# EAGLE design UP-Module-fused-IOs (EAGLE 9.4.0)
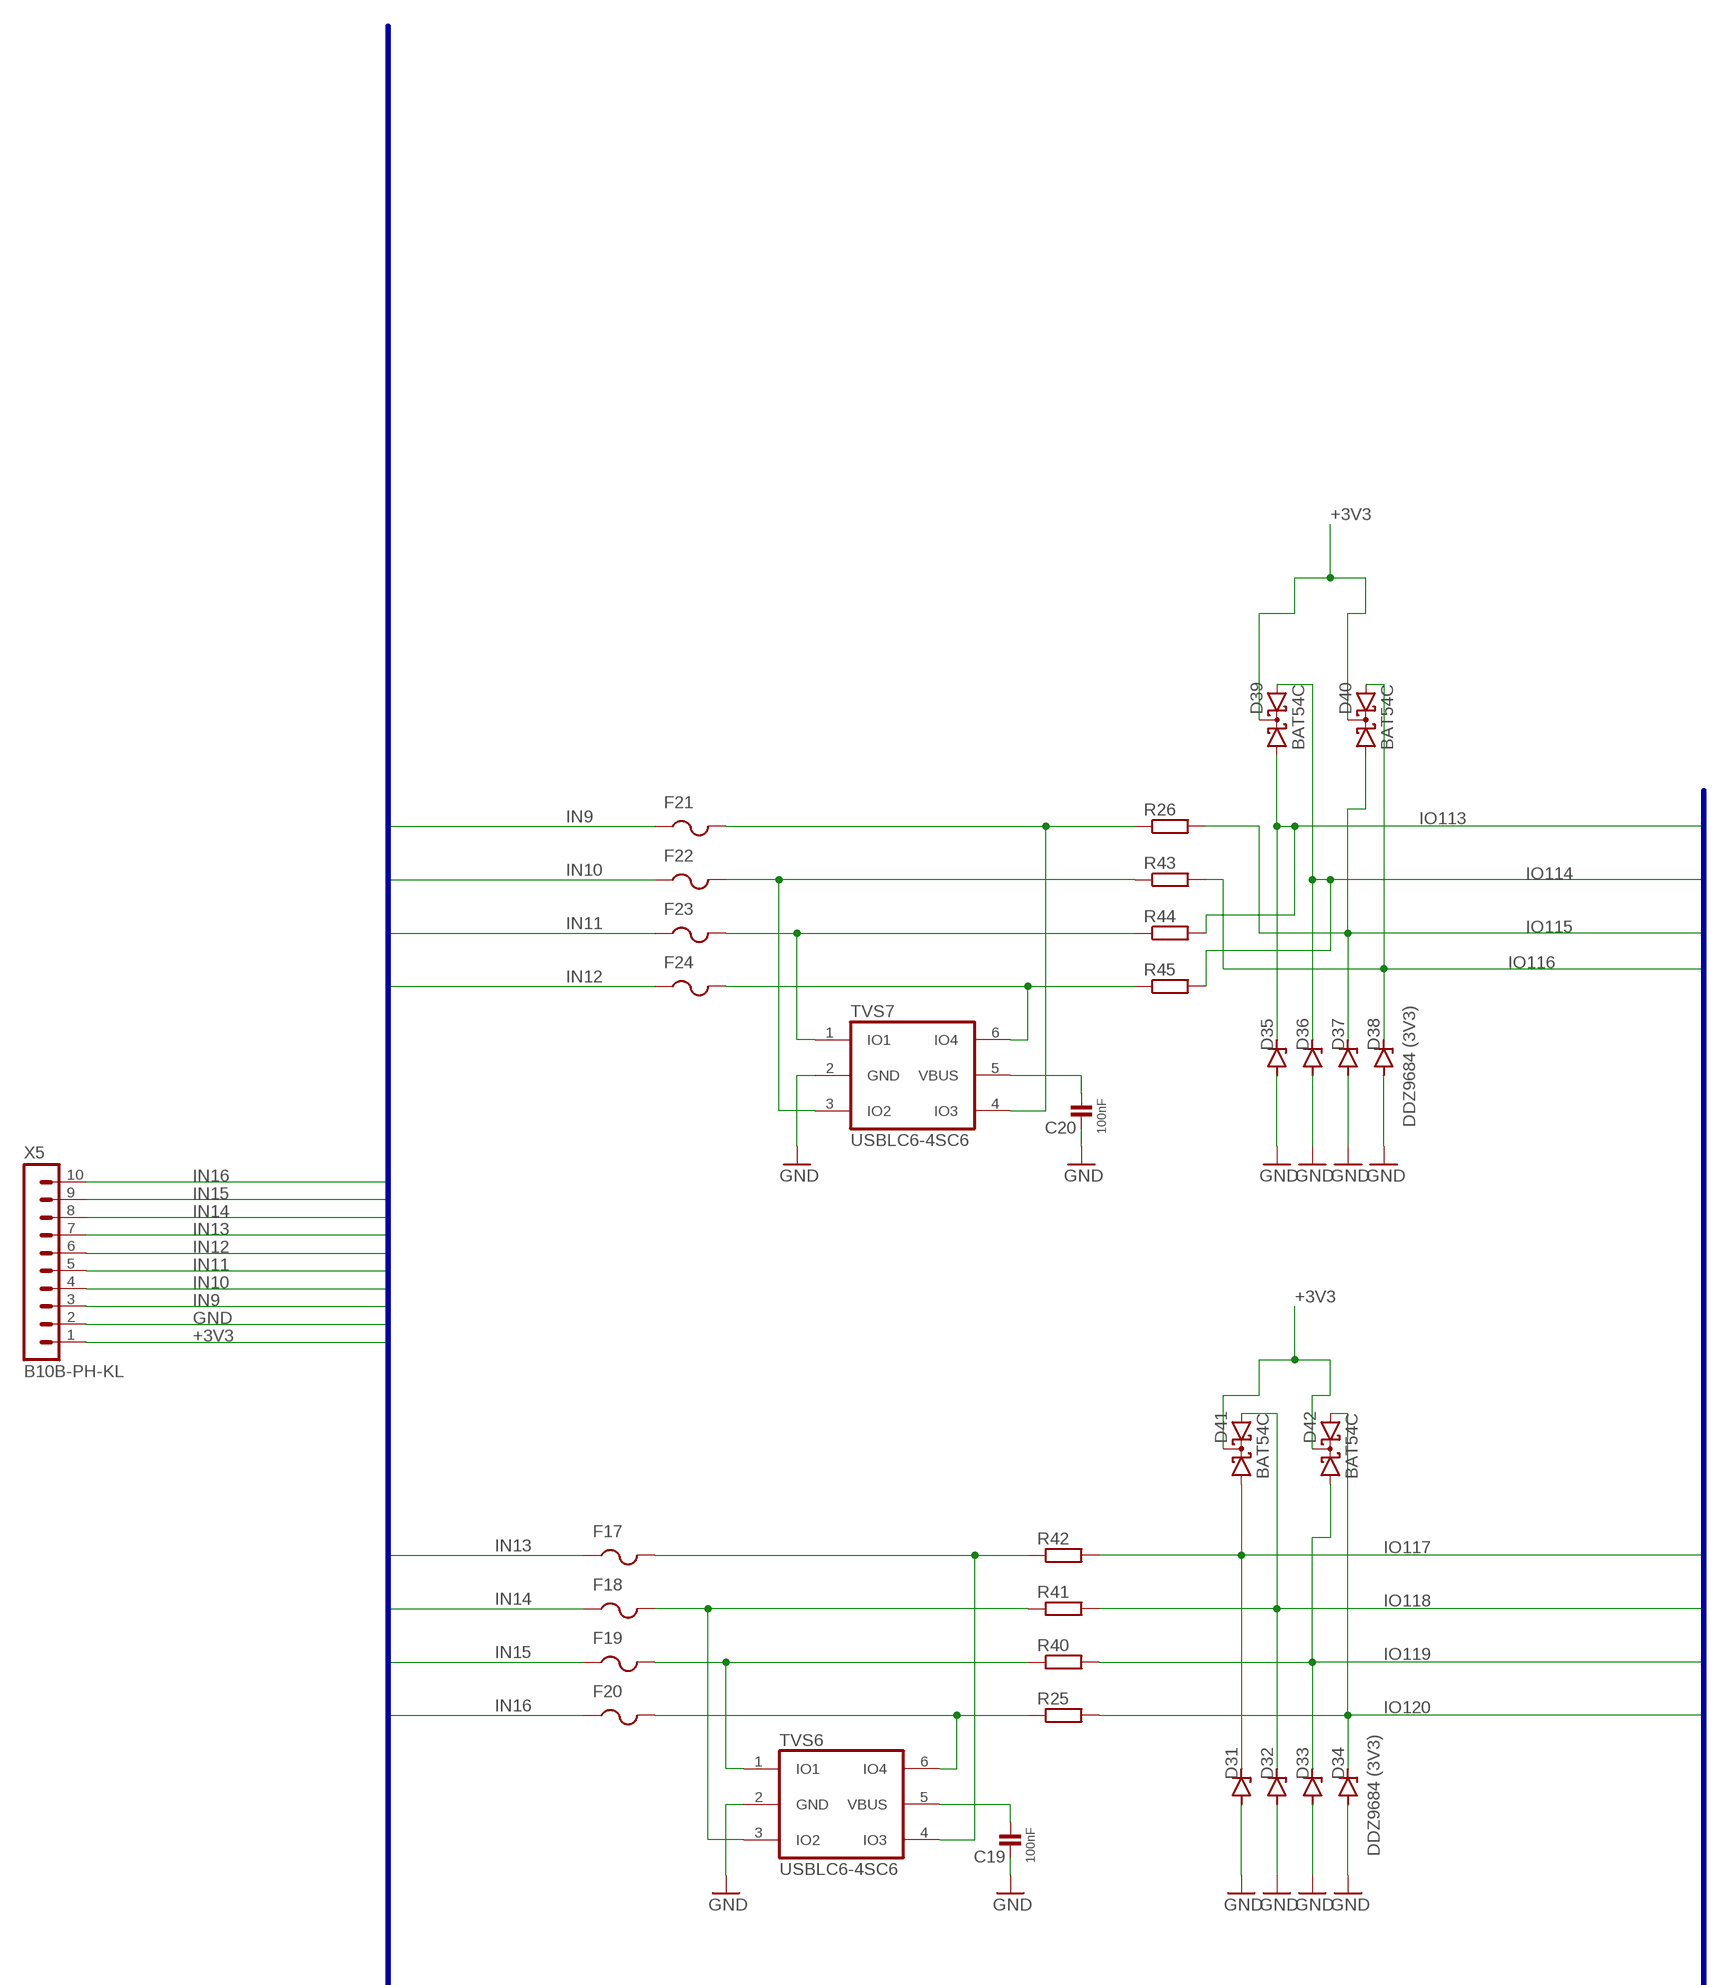
[diagram p0: schematic, sheet 1, part 1 of 3]
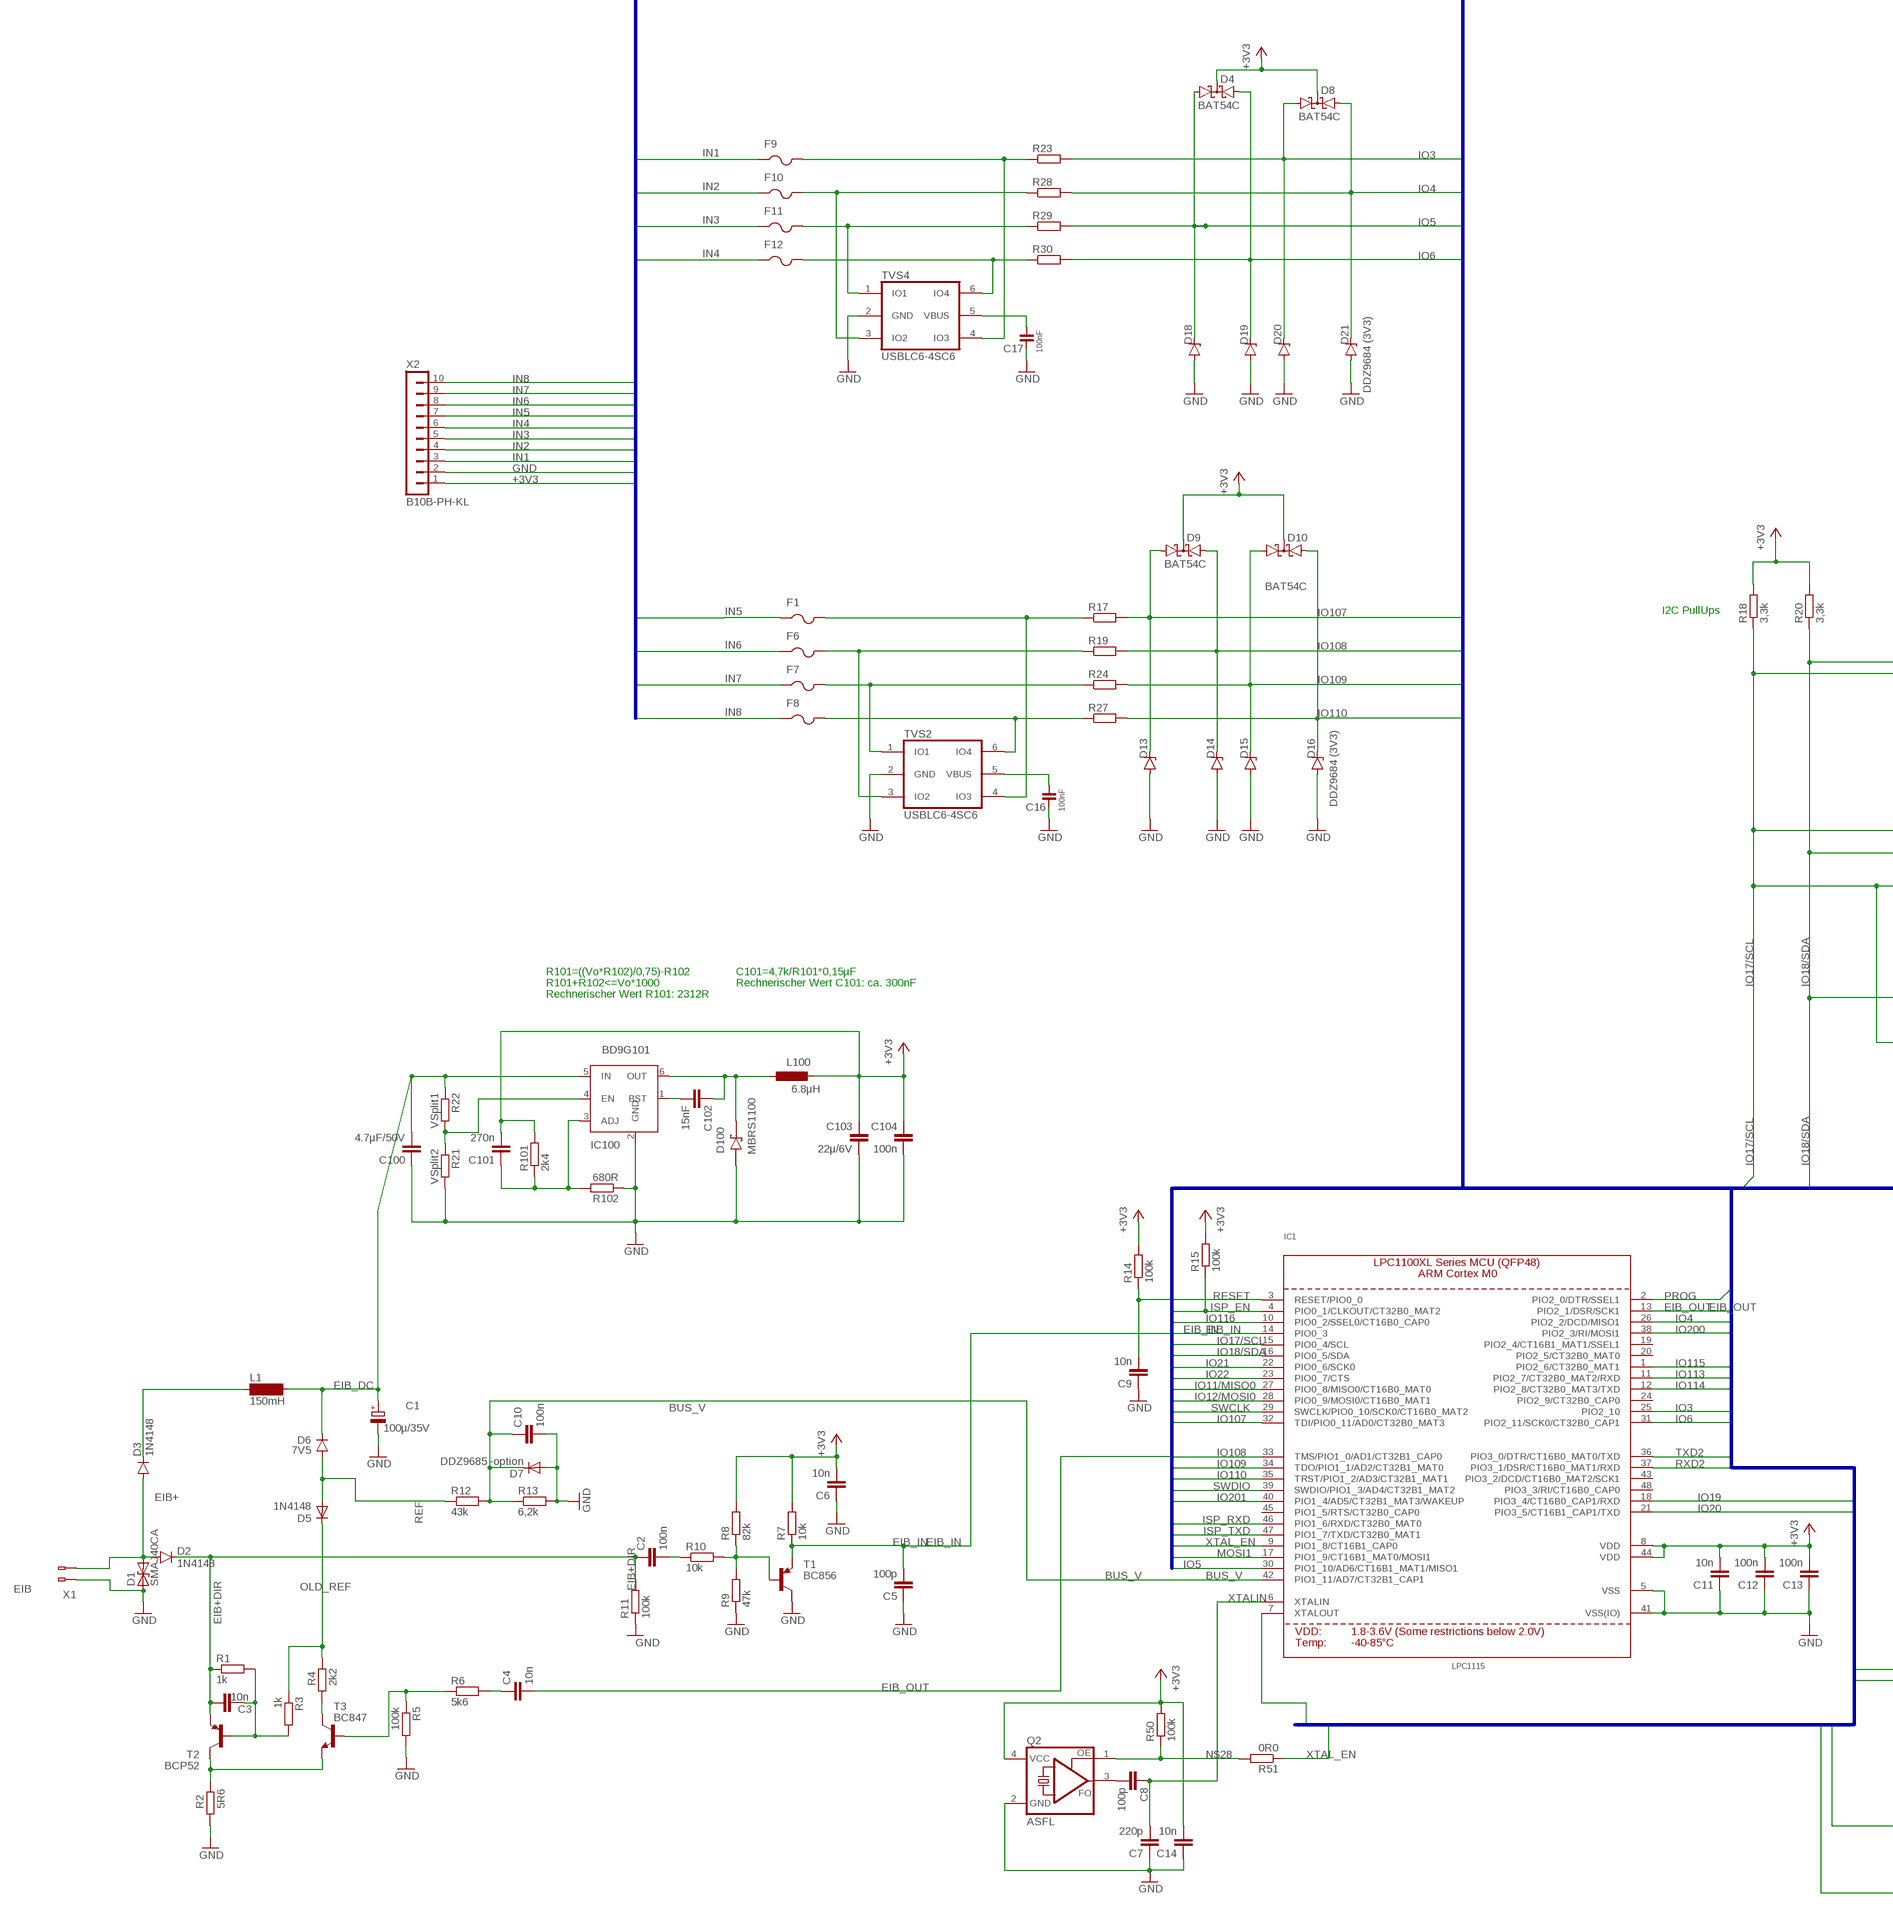
[diagram p1: schematic, sheet 1, part 2 of 3]
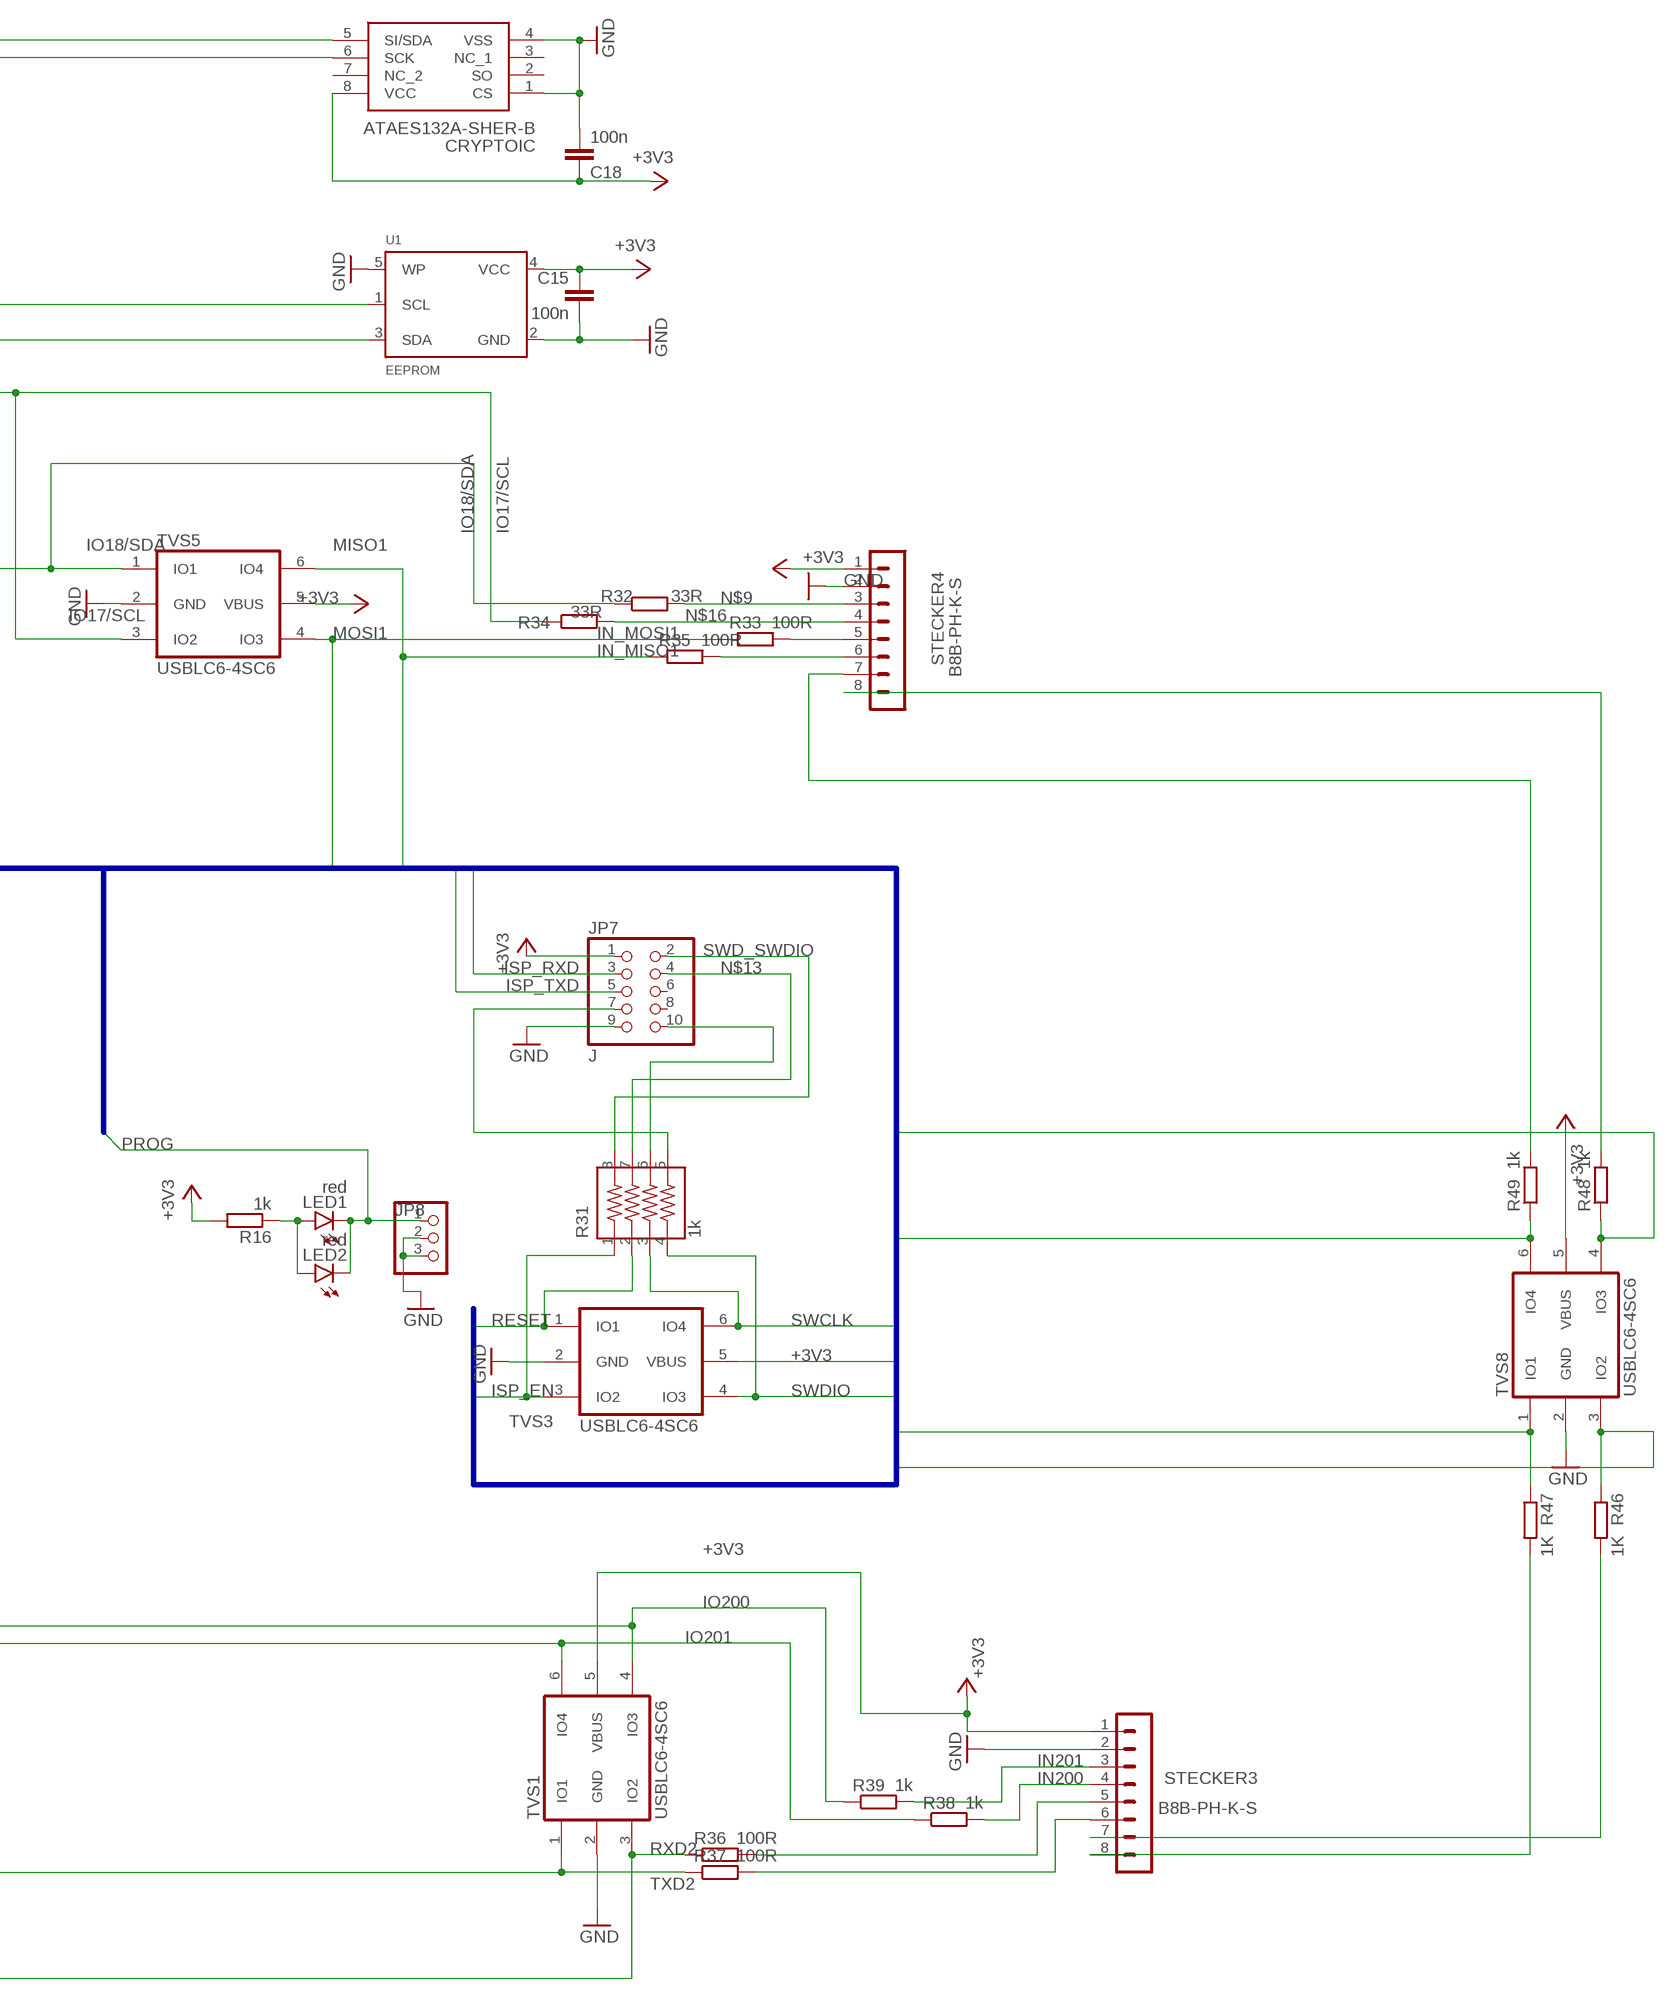
[diagram p2: schematic, sheet 1, part 3 of 3]

## Parts
C1  100µ/35V  CPOL-EUSANYO_SMD_C6  [SANYO-OSCON_SMD_C6]
C2  100n  C-EUC0805  [C0805]
C3  10n  C-EUC0805  [C0805]
C4  10n  C-EUC0805  [C0805]
C5  100p  C-EUC0805  [C0805]
C6  10n  C-EUC0805  [C0805]
C7  220p  C-EUC0805  [C0805]
C8  100p  C-EUC0805  [C0805]
C9  10n  C-EUC0805  [C0805]
C10  100n  C-EUC0805  [C0805]
C11  10n  C-EUC0805  [C0805]
C12  100n  C-EUC0805  [C0805]
C13  100n  C-EUC0805  [C0805]
C14  10n  C-EUC0805  [C0805]
C15  100n  C-EUC0805  [C0805]
C16  100nF  C-EUC0805  [C0805]
C17  100nF  C-EUC0805  [C0805]
C18  100n  C-EUC0805  [C0805]
C19  100nF  C-EUC0805  [C0805]
C20  100nF  C-EUC0805  [C0805]
C100  4.7µF/50V  C-EUC0805  [C0805]
C101  270n  C-EUC0805  [C0805]
C102  15nF  C-EUC0805  [C0805]
C103  22µ/6V  C-EUC0805  [C0805]
C104  100n  C-EUC0805  [C0805]
CRYPTOIC  ATAES132A-SHER-B  [SOIC127P600X175-8N]
D1  SMAJ40CA  [DO214AC]
D2  1N4148  DIODE-SOD323-R  [SOD323-R]
D3  1N4148  DIODE-SOD323-R  [SOD323-R]
D4  BAT54C  [SOT23]
D5  1N4148  DIODE-SOD323-R  [SOD323-R]
D6  7V5  DIODE-SOD323-R  [SOD323-R]
D7  DDZ9685 -option  DIODESOD-123  [SOD-123]
D8  BAT54C  [SOT23]
D9  BAT54C  [SOT23]
D10  BAT54C  [SOT23]
D13  DDZ9684 (3V3)  ZENER_MMSZ5240BTDO-219-AB(SOD123F)  [SODFL3718X115]
D14  DDZ9684 (3V3)  ZENER_MMSZ5240BTDO-219-AB(SOD123F)  [SODFL3718X115]
D15  DDZ9684 (3V3)  ZENER_MMSZ5240BTDO-219-AB(SOD123F)  [SODFL3718X115]
D16  DDZ9684 (3V3)  ZENER_MMSZ5240BTDO-219-AB(SOD123F)  [SODFL3718X115]
D18  DDZ9684 (3V3)  ZENER_MMSZ5240BTDO-219-AB(SOD123F)  [SODFL3718X115]
D19  DDZ9684 (3V3)  ZENER_MMSZ5240BTDO-219-AB(SOD123F)  [SODFL3718X115]
D20  DDZ9684 (3V3)  ZENER_MMSZ5240BTDO-219-AB(SOD123F)  [SODFL3718X115]
D21  DDZ9684 (3V3)  ZENER_MMSZ5240BTDO-219-AB(SOD123F)  [SODFL3718X115]
D31  DDZ9684 (3V3)  ZENER_MMSZ5240BTDO-219-AB(SOD123F)  [SODFL3718X115]
D32  DDZ9684 (3V3)  ZENER_MMSZ5240BTDO-219-AB(SOD123F)  [SODFL3718X115]
D33  DDZ9684 (3V3)  ZENER_MMSZ5240BTDO-219-AB(SOD123F)  [SODFL3718X115]
D34  DDZ9684 (3V3)  ZENER_MMSZ5240BTDO-219-AB(SOD123F)  [SODFL3718X115]
D35  DDZ9684 (3V3)  ZENER_MMSZ5240BTDO-219-AB(SOD123F)  [SODFL3718X115]
D36  DDZ9684 (3V3)  ZENER_MMSZ5240BTDO-219-AB(SOD123F)  [SODFL3718X115]
D37  DDZ9684 (3V3)  ZENER_MMSZ5240BTDO-219-AB(SOD123F)  [SODFL3718X115]
D38  DDZ9684 (3V3)  ZENER_MMSZ5240BTDO-219-AB(SOD123F)  [SODFL3718X115]
D39  BAT54C  [SOT23]
D40  BAT54C  [SOT23]
D41  BAT54C  [SOT23]
D42  BAT54C  [SOT23]
D100  MBRS1100  SCHOTTKY-DIODE-MBR130LSFT1  [SOD123FL]
F1  PTCFUSE-0805  [F0805]
F6  PTCFUSE-0805  [F0805]
F7  PTCFUSE-0805  [F0805]
F8  PTCFUSE-0805  [F0805]
F9  PTCFUSE-0805  [F0805]
F10  PTCFUSE-0805  [F0805]
F11  PTCFUSE-0805  [F0805]
F12  PTCFUSE-0805  [F0805]
F17  PTCFUSE-0805  [F0805]
F18  PTCFUSE-0805  [F0805]
F19  PTCFUSE-0805  [F0805]
F20  PTCFUSE-0805  [F0805]
F21  PTCFUSE-0805  [F0805]
F22  PTCFUSE-0805  [F0805]
F23  PTCFUSE-0805  [F0805]
F24  PTCFUSE-0805  [F0805]
IC1  LPC1115  LPC1113/4/5_QFP48_XLSERIES  [LQFP48]
IC100  BD9G101  BD9G101GBD9G101G-SOT23-6  [SOT23-6]
JP7  J  PINHD-2X05_2.00  [2X05M]
JP8  PINHD-1X3  [1X03]
L1  150mH  BS11  [BS11]
L100  6.8µH  L-EUL4532P  [L4532P]
LED1  red  LEDCHIPLED_1206  [CHIPLED_1206]
LED2  red  LED3MM  [LED3MM]
Q2  ASFL  [ASF]
R1  1k  R-EU_R0805  [R0805]
R2  5R6  R-EU_R0805  [R0805]
R3  1k  R-EU_R0805  [R0805]
R4  2k2  R-EU_R0805  [R0805]
R5  100k  R-EU_R0805  [R0805]
R6  5k6  R-EU_R0805  [R0805]
R7  10k  R-EU_R0805  [R0805]
R8  82k  R-EU_R0805  [R0805]
R9  47k  R-EU_R0805  [R0805]
R10  10k  R-EU_R0805  [R0805]
R11  100k  R-EU_R0805  [R0805]
R12  43k  R-EU_R0805  [R0805]
R13  6,2k  R-EU_R0805  [R0805]
R14  100k  R-EU_R0805  [R0805]
R15  100k  R-EU_R0805  [R0805]
R16  1k  R-EU_R0805  [R0805]
R17  R-EU_R0805  [R0805]
R18  3,3k  R-EU_R0805  [R0805]
R19  R-EU_R0805  [R0805]
R20  3,3k  R-EU_R0805  [R0805]
R21  VSplit2  R-EU_R0805  [R0805]
R22  VSplit1  R-EU_R0805  [R0805]
R23  R-EU_R0805  [R0805]
R24  R-EU_R0805  [R0805]
R25  R-EU_R0805  [R0805]
R26  R-EU_R0805  [R0805]
R27  R-EU_R0805  [R0805]
R28  R-EU_R0805  [R0805]
R29  R-EU_R0805  [R0805]
R30  R-EU_R0805  [R0805]
R31  1k  YC164-JR-0733RL  [YC164-JR-0733RL]
R32  33R  R-EU_R0805  [R0805]
R33  100R  R-EU_R0805  [R0805]
R34  33R  R-EU_R0805  [R0805]
R35  100R  R-EU_R0805  [R0805]
R36  100R  R-EU_R0805  [R0805]
R37  100R  R-EU_R0805  [R0805]
R38  1k  R-EU_R0805  [R0805]
R39  1k  R-EU_R0805  [R0805]
R40  R-EU_R0805  [R0805]
R41  R-EU_R0805  [R0805]
R42  R-EU_R0805  [R0805]
R43  R-EU_R0805  [R0805]
R44  R-EU_R0805  [R0805]
R45  R-EU_R0805  [R0805]
R46  1K  R-EU_R0805  [R0805]
R47  1K  R-EU_R0805  [R0805]
R48  1k  R-EU_R0805  [R0805]
R49  1k  R-EU_R0805  [R0805]
R50  100k  R-EU_R0805  [R0805]
R51  0R0  R-EU_R0805  [R0805]
R101  2k4  R-EU_R0805  [R0805]
R102  680R  R-EU_R0805  [R0805]
STECKER3  B8B-PH-K-S  [B8B-PH-K-S]
STECKER4  B8B-PH-K-S  [B8B-PH-K-S]
T1  BC856  BC856BSMD  [SOT23-BEC]
T2  BCP52  FZT753SMD  [SOT223]
T3  BC847  [SOT23]
TVS1  USBLC6-4SC6  [SOT-23-6L]
TVS2  USBLC6-4SC6  [SOT-23-6L]
TVS3  USBLC6-4SC6  [SOT-23-6L]
TVS4  USBLC6-4SC6  [SOT-23-6L]
TVS5  USBLC6-4SC6  [SOT-23-6L]
TVS6  USBLC6-4SC6  [SOT-23-6L]
TVS7  USBLC6-4SC6  [SOT-23-6L]
TVS8  USBLC6-4SC6  [SOT-23-6L]
U1  EEPROM  EEPROM_I2C_MCP24AA32  [SOT23-5]
X1  EIB  [BUSKLEMME243-724]
X2  B10B-PH-KL  [B10B-PH-K-S]
X5  B10B-PH-KL  [B10B-PH-K-S]

## Nets
+3V3: C6.2 C11.2 C12.2 C13.2 C14.2 C15.1 C18.1 C101.2 C103.1 C104.1 CRYPTOIC.8(VCC) D4.3(CC) D8.3(CC) D9.3(CC) D10.3(CC) D39.3(CC) D40.3(CC) D41.3(CC) D42.3(CC) IC1.8(VDD) IC1.44(VDD) JP7.1 L100.2 Q2.4(VCC) R7.2 R8.2 R14.2 R15.2 R16.2 R18.2 R20.2 R50.2 R101.2 STECKER3.1 STECKER4.1 TVS1.5(VBUS) TVS3.5(VBUS) TVS5.5(VBUS) TVS8.5(VBUS) U1.4(VCC) X2.1 X5.1
BST: C102.2 IC100.1(BST)
BUS_V: C10.2 D7.C IC1.42(PIO1_11/AD7/CT32B1_CAP1) R12.2 R13.1
EIB+: D1.C D2.A D3.A X1.2(B-2)
EIB+DIR: C2.1 C3.1 D2.C R1.1 R11.2 T2.3(E)
EIB_DC: C1.+ C100.2 D6.C IC100.5(IN) L1.2 R22.1
EIB_IN: C5.2 IC1.14(PIO0_3) R7.1 T1.E
EIB_OUT: C4.2 IC1.13(PIO2_1/DSR/SCK1)
FB: C101.1 IC100.3(ADJ) R101.1 R102.2
GND: C1.- C5.1 C6.1 C7.1 C9.1 C10.1 C11.1 C12.1 C13.1 C14.1 C15.2 C16.1 C17.1 C18.2 C19.1 C20.1 C100.1 C103.2 C104.2 CRYPTOIC.1(CS) CRYPTOIC.4(VSS) D1.A D7.A D13.2(A) D14.2(A) D15.2(A) D16.2(A) D18.2(A) D19.2(A) D20.2(A) D21.2(A) D31.2(A) D32.2(A) D33.2(A) D34.2(A) D35.2(A) D36.2(A) D37.2(A) D38.2(A) D100.A IC1.5(VSS) IC1.41(VSS(IO)) IC100.2(GND) JP7.9 JP8.2 JP8.3 Q2.2(GND) R2.1 R5.2 R9.1 R11.1 R13.2 R21.2 R102.1 STECKER3.2 STECKER4.2 T1.C TVS1.2(GND) TVS2.2(GND) TVS3.2(GND) TVS4.2(GND) TVS5.2(GND) TVS6.2(GND) TVS7.2(GND) TVS8.2(GND) U1.2(GND) U1.5(WP) X1.1(B-1) X2.2 X5.2
IN1: F9.1 X2.3
IN2: F10.1 X2.4
IN3: F11.1 X2.5
IN4: F12.1 X2.6
IN5: F1.1 X2.7
IN6: F6.1 X2.8
IN7: F7.1 X2.9
IN8: F8.1 X2.10
IN9: F21.1 X5.3
IN10: F22.1 X5.4
IN11: F23.1 X5.5
IN12: F24.1 X5.6
IN13: F17.1 X5.7
IN14: F18.1 X5.8
IN15: F19.1 X5.9
IN16: F20.1 X5.10
IN200: R38.2 STECKER3.4
IN201: R39.2 STECKER3.3
IN_MISO1: R35.2 STECKER4.6
IN_MOSI1: R33.2 STECKER4.5
IO3: D8.1(A1) D20.1(C) IC1.25(PIO2_10) R23.2
IO4: D8.2(A2) D21.1(C) IC1.26(PIO2_2/DCD/MISO1) R28.2
IO5: D4.1(A1) D18.1(C) IC1.30(PIO1_10/AD6/CT16B1_MAT1/MISO1) R29.2
IO6: D4.2(A2) D19.1(C) IC1.31(PIO2_11/SCK0/CT32B0_CAP1) R30.2
IO11/MISO0: IC1.27(PIO0_8/MISO0/CT16B0_MAT0)
IO12/MOSI0: IC1.28(PIO0_9/MOSI0/CT16B0_MAT1)
IO17/SCL: CRYPTOIC.6(SCK) IC1.15(PIO0_4/SCL) R18.1 R34.1 TVS5.3(IO2) U1.1(SCL)
IO18/SDA: CRYPTOIC.5(SI/SDA) IC1.16(PIO0_5/SDA) R20.1 R32.1 TVS5.1(IO1) U1.3(SDA)
IO19: IC1.18(PIO3_4/CT16B0_CAP1/RXD) R47.1 TVS8.1(IO1)
IO20: IC1.21(PIO3_5/CT16B1_CAP1/TXD) R46.1 TVS8.3(IO2)
IO21: IC1.22(PIO0_6/SCK0) R49.1 TVS8.6(IO4)
IO22: IC1.23(PIO0_7/CTS) R48.1 TVS8.4(IO3)
IO107: D9.1(A1) D13.1(C) IC1.32(TDI/PIO0_11/AD0/CT32B0_MAT3) R17.2
IO108: D9.2(A2) D14.1(C) IC1.33(TMS/PIO1_0/AD1/CT32B1_CAP0) R19.2
IO109: D10.1(A1) D15.1(C) IC1.34(TDO/PIO1_1/AD2/CT32B1_MAT0) R24.2
IO110: D10.2(A2) D16.1(C) IC1.35(TRST/PIO1_2/AD3/CT32B1_MAT1) R27.2
IO113: D35.1(C) D39.1(A1) IC1.11(PIO2_7/CT32B0_MAT2/RXD) R44.2
IO114: D36.1(C) D39.2(A2) IC1.12(PIO2_8/CT32B0_MAT3/TXD) R45.2
IO115: D37.1(C) D40.1(A1) IC1.1(PIO2_6/CT32B0_MAT1) R26.2
IO116: D38.1(C) D40.2(A2) IC1.10(PIO0_2/SSEL0/CT16B0_CAP0) R43.2
IO117: D31.1(C) D41.1(A1) R42.2
IO118: D32.1(C) D41.2(A2) R41.2
IO119: D33.1(C) D42.1(A1) R40.2
IO120: D34.1(C) D42.2(A2) R25.2
IO200: IC1.38(PIO2_3/RI/MOSI1) R39.1 TVS1.4(IO3)
IO201: IC1.40(PIO1_4/AD5/CT32B1_MAT3/WAKEUP) R38.1 TVS1.6(IO4)
ISP_EN: IC1.4(PIO0_1/CLKOUT/CT32B0_MAT2) R15.1 R31.1 TVS3.3(IO2)
ISP_RXD: IC1.46(PIO1_6/RXD/CT32B0_MAT0) JP7.3
ISP_TXD: IC1.47(PIO1_7/TXD/CT32B0_MAT1) JP7.5
LX: C102.1 D100.C IC100.6(OUT) L100.1
MISO1: R35.1 TVS5.6(IO4)
MOSI1: IC1.17(PIO1_9/CT16B1_MAT0/MOSI1) R33.1 TVS5.4(IO3)
N$1: C2.2 R10.1
N$2: D3.C L1.1
N$3: C4.1 R6.2
N$5: IC100.4(EN) R21.1 R22.2
N$6: R4.1 T3.3(C)
N$7: R2.2 T2.2(C) T2.4(C) T3.2(E)
N$8: JP7.7 R31.5
N$9: R32.2 STECKER4.3
N$10: C8.2 Q2.3(FO)
N$11: JP7.10 R31.6
N$12: R5.1 R6.1 T3.1(B)
N$13: JP7.4 R31.7
N$14: R8.1 R9.2 R10.2 T1.B
N$15: C3.2 R1.2 R3.2 T2.1(B)
N$16: R34.2 STECKER4.4
N$18: F1.2 R17.1 TVS2.4(IO3)
N$19: F6.2 R19.1 TVS2.3(IO2)
N$20: F7.2 R24.1 TVS2.1(IO1)
N$21: F8.2 R27.1 TVS2.6(IO4)
N$22: C16.2 TVS2.5(VBUS)
N$23: F10.2 R28.1 TVS4.3(IO2)
N$24: F12.2 R30.1 TVS4.6(IO4)
N$25: C17.2 TVS4.5(VBUS)
N$26: F11.2 R29.1 TVS4.1(IO1)
N$27: F9.2 R23.1 TVS4.4(IO3)
N$28: Q2.1(OE) R50.1 R51.2
N$29: R36.2 STECKER3.5
N$30: R37.2 STECKER3.6
N$33: F18.2 R41.1 TVS6.3(IO2)
N$34: F20.2 R25.1 TVS6.6(IO4)
N$35: C19.2 TVS6.5(VBUS)
N$36: F19.2 R40.1 TVS6.1(IO1)
N$37: F17.2 R42.1 TVS6.4(IO3)
N$38: F22.2 R43.1 TVS7.3(IO2)
N$39: F24.2 R45.1 TVS7.6(IO4)
N$40: C20.2 TVS7.5(VBUS)
N$41: LED1.A LED2.A R16.1
N$42: F23.2 R44.1 TVS7.1(IO1)
N$43: F21.2 R26.1 TVS7.4(IO3)
N$47: R47.2 STECKER3.8
N$48: R46.2 STECKER3.7
N$49: R49.2 STECKER4.7
N$52: R48.2 STECKER4.8
OLD_REF: D5.C R3.1 R4.2
PROG: IC1.2(PIO2_0/DTR/SSEL1) JP8.1 LED1.C LED2.K(C)
REF: D5.A D6.A R12.1
RESET: C9.2 IC1.3(RESET/PIO0_0) R14.1 R31.2 TVS3.1(IO1)
RXD2: IC1.37(PIO3_1/DSR/CT16B0_MAT1/RXD) R36.1 TVS1.3(IO2)
SWCLK: IC1.29(SWCLK/PIO0_10/SCK0/CT16B0_MAT2) R31.3 TVS3.6(IO4)
SWD_SWDIO: JP7.2 R31.8
SWDIO: IC1.39(SWDIO/PIO1_3/AD4/CT32B1_MAT2) R31.4 TVS3.4(IO3)
TXD2: IC1.36(PIO3_0/DTR/CT16B0_MAT0/TXD) R37.1 TVS1.1(IO1)
XTAL_EN: IC1.9(PIO1_8/CT16B1_CAP0) R51.1
XTALIN: C7.2 C8.1 IC1.6(XTALIN)
XTALOUT: IC1.7(XTALOUT)
Unconnected: CRYPTOIC.2(SO) CRYPTOIC.3(NC_1) CRYPTOIC.7(NC_2) IC1.19(PIO2_4/CT16B1_MAT1/SSEL1) IC1.20(PIO2_5/CT32B0_MAT0) IC1.24(PIO2_9/CT32B0_CAP0) IC1.43(PIO3_2/DCD/CT16B0_MAT2/SCK1) IC1.45(PIO1_5/RTS/CT32B0_CAP0) IC1.48(PIO3_3/RI/CT16B0_CAP0) JP7.6 JP7.8

## Buses
+3V3,BST,BUS_V,EIB+,EIB_DC,EIB+DIR,EIB_IN,EIB_OUT,FB,GND,ID,IN[1..16],IN[200..220],IO[1..17],IO11/MISO0,IO12/MOSI0,IO17/SCL,IO18,IO18/SDA,IO[19..22],IO[107..110],IO[113..120],IO[200..220],ISP_EN,ISP_RXD,ISP_TXD,LX,MISO1,MOSI1,N$1,N$2,N$3,N$5,N$6,N$7,N$8,N$9,N$10,N$11,N$12,N$13,N$14,N$15,N$18,N$19,N$20,N$21,N$22,N$23,N$24,N$25,N$26,N$27,N$33,N$34,N$35,N$36,N$37,N$38,N$39,N$40,N$41,N$42,N$43,OLD_REF,PROG,REF,RESET,RXD,RXD2,SWCLK,SWDIO,SWD_SWDIO,TXD,TXD2,XTAL_EN,XTALIN,XTALOUT
+3V3,GND,IN[1..10],IN13,IN14,IN15,IN16

## Notes on the sheet
- I2C PullUps
- R101=((Vo*R102)/0,75)-R102 | C101=4,7k/R101*0,15µF
- R101+R102<=Vo*1000 | Rechnerischer Wert C101: ca. 300nF
- Rechnerischer Wert R101: 2312R

## Library data of the parts
C1 = rcl:CPOL-EU: POLARIZED CAPACITOR, European symbol; REICHELT: VF 100/35 K-D8; SPICEPREFIX: C
C2 C10 C12 C13 C15 C18 C104 = rcl:C-EU: CAPACITOR, European symbol; REICHELT: X7R-G0805 100N; SPICEPREFIX: C
C3 C4 C6 C9 C11 = rcl:C-EU: CAPACITOR, European symbol; REICHELT: X7R-G0805 10N; SPICEPREFIX: C
C5 = rcl:C-EU: CAPACITOR, European symbol; REICHELT: NPO-G0805 100P; SPICEPREFIX: C
C7 C8 C14 = rcl:C-EU: CAPACITOR, European symbol; SPICEPREFIX: C
C16 C17 C19 C20 = MyRCL:C-EU: CAPACITOR, European symbol; SPICEPREFIX: C
C100 = rcl:C-EU: CAPACITOR, European symbol; REICHELT: X7R-G1206 4,7/50; SPICEPREFIX: C
C101 = rcl:C-EU: CAPACITOR, European symbol; REICHELT: Y5R-G0603 220N; SPICEPREFIX: C
C102 = rcl:C-EU: CAPACITOR, European symbol; REICHELT: X7R-G0805 15N; SPICEPREFIX: C
C103 = rcl:C-EU: CAPACITOR, European symbol; REICHELT: X5R-G0805 22/6; SPICEPREFIX: C
CRYPTOIC = SamacSys_Parts:ATAES132A-SHER-B: MICROCHIP - ATAES132A-SHER-B - SERIAL EEPROM, 32KBIT, 1MHZ, WSOIC-8 Source: Datasheet <https://componentsearchengine.com/Datasheets/2/ATAES132A-SHER-B.pdf>; DESCRIPTION: MICROCHIP - ATAES132A-SHER-B - SERIAL EEPROM, 32KBIT, 1MHZ, WSOIC-8; HEIGHT: 1.75mm; MANUFACTURER_NAME: Microchip; MANUFACTURER_PART_NUMBER: ATAES132A-SHER-B; MOUSER_PART_NUMBER: 556-ATAES132A-SHER-B; MOUSER_PRICE-STOCK: https://www.mouser.co.uk/ProductDetail/Microchip-Technology-Atmel/ATAES132A-SHER-B?qs=9KdFJXLqUo%2FaVYGdCdKzLQ%3D%3D
D1 = smaj_10:SMAJ*CA: SMAJ Series TVS Diodes Source: http://www.littelfuse.com/~/media/electronics/datasheets/tvs_diodes/littelfuse_tvs_diode_smaj_datasheet.pdf.pdf; MF: Littelfuse; MPN: SMAJ40CA; OC_FARNELL: 1827675; OC_NEWARK: 71J2019
D2 D3 D5 = diode:DIODE-: DIODE; REICHELT: 1N 4148 SMD
D4 D8-D10 D39-D42 = diode:BAT54C: Schottky Diodes Source: Fairchild .. BAT54.pdf
D6 = diode:DIODE-: DIODE; REICHELT: SMD ZF 7,5
D7 = microbuilder:DIODE: Diode SMA Model Volts Amps Type Vf Vr Digikey # Notes SSA34-E3 40V 3A Schottky 480mV @ 3A 200uA @ 40V SSA34-E3/61TGITR-ND CDBA120-G 20V 1A Schottky 500mV @ 1A 500uA @ 20V 641-1014-6-ND REEL MBRA210 10V 2A Schottky 350mV @ 2A 700uA @ 10V MBRA210LT3 SOD-123 Model Volts Amps Type Vf Vr Order # Notes BAT54T1G 30V 200mA Schottky 800mV @ 200mA 2uA @ 25V BAT54T1GOSTR-ND B0530W 30V 500mA Schottky 430mV @ 500mA 130uA @ 30V B0530W-FDICT-ND REEL MBR120 1A 20V Schottky 340mV @ 1A MBR120VLSFT1GOSCT-ND SOD-323 Model Volts Amps Type Vf Vr Order # Notes PMEG2005EJ 20V 500mA Schottky 355mV @ 500mA 568-4110-1-ND ZLLS410 10V 570mA Schottky 380mV @ 570mA ZLLS410CT-ND 1N4148WS 75V 150mA Silicon/Simple 1V 1N4148WSFSCT-ND REEL SOD-523 Model Volts Amps Type Vf Vr Order # Notes BAT54XV2 30V 200mA Schottky 0.8V @ 100mA BAT54XV2CT-ND TB751S 30V 30mA Schottky RB751S-40TE61CT-ND SOT23-R/W (R = Solder Paste/Reflow Ovens, W = Hand-Soldering) Model Volts Amps Type Vf Vr Order # Notes BAT54FILM 40V 300mA Schottky 497-7162-1-ND; REICHELT: SMD ZF 3,6
D13-D16 D18-D21 D31-D38 = Diode:ZENER_: Zener Diode - Popular parts; CATEGORY: Diode; DESCRIPTION: DIODE ZENER 10V 500MW SOD123; MANUFACTURER: ON Semiconductor; MPN: MMSZ5240BT1G; SUB-CATEGORY: Zener; THERMALLOSS: 0.5W; VALUE: MMSZ5240BT1G
D100 = bt_diode:SCHOTTKY-DIODE: Schottky Diode; REICHELT: MBRS 1100 SMD
F1 F6-F12 F17-F24 = MyFuse:PTCFUSE: PTC fuses, resettable thermistors
IC1 = microbuilder:LPC1113/4/5_QFP48_XLSERIES: LPC1113/4/5 ARM Cortex M0 MCU (50MHz) - XL Series (FBD48/3x3) LPC1115FBD48/303: Max Frequency: 50MHz Flash: 64kB SRAM: 8kB ADC: 10-bit
IC100 = Stefan_selfbus:BD9G101G
JP7 = pinhead-2:PINHD-2X05: PIN HEADER; REICHELT: MPE 150-3-010
JP8 = pinhead_dmx:PINHD-1X3: PIN HEADER
L1 = inductor-neosid_changed:BS: INDUCTOR nominal inductance, magnetically screened; OC_FARNELL: unknown; OC_NEWARK: unknown; REICHELT: L-11P 150M
L100 = rcl_changed:L-EU: INDUCTOR, European symbol; REICHELT: L-1616FPS 6,8µ; SPICEPREFIX: L
LED1 LED2 = led:LED: LED OSRAM: - CHIPLED LG R971, LG N971, LY N971, LG Q971, LY Q971, LO R971, LY R971 LH N974, LH R974 LS Q976, LO Q976, LY Q976 LO Q996 - Hyper CHIPLED LW Q18S LB Q993, LB Q99A, LB R99A - SideLED LS A670, LO A670, LY A670, LG A670, LP A670 LB A673, LV A673, LT A673, LW A673 LH A674 LY A675 LS A676, LA A676, LO A676, LY A676, LW A676 LS A679, LY A679, LG A679 - Hyper Micro SIDELED® LS Y876, LA Y876, LO Y876, LY Y876 LT Y87S - SmartLED LW L88C, LW L88S LB L89C, LB L89S, LG L890 LS L89K, LO L89K, LY L89K LS L896, LA L896, LO L896, LY L896 - TOPLED LS T670, LO T670, LY T670, LG T670, LP T670 LSG T670, LSP T670, LSY T670, LOP T670, LYG T670 LG T671, LOG T671, LSG T671 LB T673, LV T673, LT T673, LW T673 LH T674 LS T676, LA T676, LO T676, LY T676, LB T676, LH T676, LSB T676, LW T676 LB T67C, LV T67C, LT T67C, LS T67K, LO T67K, LY T67K, LW E67C LS E67B, LA E67B, LO E67B, LY E67B, LB E67C, LV E67C, LT E67C LW T67C LS T679, LY T679, LG T679 LS T770, LO T770, LY T770, LG T770, LP T770 LB T773, LV T773, LT T773, LW T773 LH T774 LS E675, LA E675, LY E675, LS T675 LS T776, LA T776, LO T776, LY T776, LB T776 LHGB T686 LT T68C, LB T68C - Hyper Mini TOPLED® LB M676 - Mini TOPLED Santana® LG M470 LS M47K, LO M47K, LY M47K Source: http://www.osram.convergy.de LUXEON: - LUMILED® LXK2-PW12-R00, LXK2-PW12-S00, LXK2-PW14-U00, LXK2-PW14-V00 LXK2-PM12-R00, LXK2-PM12-S00, LXK2-PM14-U00 LXK2-PE12-Q00, LXK2-PE12-R00, LXK2-PE12-S00, LXK2-PE14-T00, LXK2-PE14-U00 LXK2-PB12-K00, LXK2-PB12-L00, LXK2-PB12-M00, LXK2-PB14-N00, LXK2-PB14-P00, LXK2-PB14-Q00 LXK2-PR12-L00, LXK2-PR12-M00, LXK2-PR14-Q00, LXK2-PR14-R00 LXK2-PD12-Q00, LXK2-PD12-R00, LXK2-PD12-S00 LXK2-PH12-R00, LXK2-PH12-S00 LXK2-PL12-P00, LXK2-PL12-Q00, LXK2-PL12-R00 Source: www.luxeon.com KINGBRIGHT: KA-3528ASYC Source: www.kingbright.com; REICHELT: SMD-LED 0805 RT
Q2 = crystal:ASF*: CRYSTAL CLOCK OSCILLATORS 5.0 Vdc or 3.3 Vdc - LOW PROFILE ULTRA MINIATURE CERAMIC SURFACE MOUNT Source: http://www.abracon.com/Oscillators/asf1-L-L1.pdf; MPN: ASFLM1-50.000MHZ-C-T; OC_FARNELL: 1838931; OC_NEWARK: 99M0411
R1 R3 R16 = rcl:R-EU_: RESISTOR, European symbol; REICHELT: SMD-0805 1,00K; SPICEPREFIX: R
R2 = rcl:R-EU_: RESISTOR, European symbol; REICHELT: SMD-0805 5,60; SPICEPREFIX: R
R4 = rcl:R-EU_: RESISTOR, European symbol; REICHELT: SMD-0805 2,20K; SPICEPREFIX: R
R5 R11 R14 R15 = rcl:R-EU_: RESISTOR, European symbol; REICHELT: SMD-0805 100K; SPICEPREFIX: R
R6 = rcl:R-EU_: RESISTOR, European symbol; REICHELT: SMD-0805 5,60K; SPICEPREFIX: R
R7 R10 R13 = rcl:R-EU_: RESISTOR, European symbol; REICHELT: SMD-0805 10,0K; SPICEPREFIX: R
R8 R32-R39 R46-R49 = rcl:R-EU_: RESISTOR, European symbol; REICHELT: SMD-0805 82,0K; SPICEPREFIX: R
R9 R50 R51 = rcl:R-EU_: RESISTOR, European symbol; REICHELT: SMD-0805 47,0K; SPICEPREFIX: R
R12 = rcl:R-EU_: RESISTOR, European symbol; REICHELT: SMD 1/4W 91K; SPICEPREFIX: R
R17 R19 R21-R30 R40-R45 = rcl:R-EU_: RESISTOR, European symbol; SPICEPREFIX: R
R18 R20 = rcl:R-EU_: RESISTOR, European symbol; REICHELT: SMD-0805 3,30K; SPICEPREFIX: R
R31 = Resistor Array:YC164-JR-0733RL: RES ARRAY 4 RES 33 OHM 1206 Manufacturer's datasheet <https://www.yageo.com/upload/media/product/productsearch/datasheet/rchip/PYu-YC_TC_group_51_RoHS_L_9.pdf>; CREATED_BY: PCBLayout.com; DIGIKEY_PN: YC164J-33TR-ND; MANUFACTURER: Yageo; MPN: YC164-JR-0733RL; PACKAGE: 1206
R101 = rcl:R-EU_: RESISTOR, European symbol; REICHELT: SMD 1/4W 2,4K; SPICEPREFIX: R
R102 = rcl:R-EU_: RESISTOR, European symbol; REICHELT: SMD-0805 680; SPICEPREFIX: R
STECKER3 STECKER4 = con-JST PH:B8B-PH: JST PH series header 2.00mm pitch disconnectable crimp style connectors, vertical (side entry type), 8 pins
T1 = transistor-pnp:BC856*: PNP Transistror; REICHELT: BC 856B SMD
T2 = transistor-pnp:FZT753SMD: PNP Transistor; REICHELT: BCP 52-16 SMD
T3 = transistor:BC847: NPN TRANSISTOR; REICHELT: BC 847C SMD
TVS1-TVS8 = usblc6:USBLC6-4: Very low capacitance ESD protection 4 line Features 4 data-line protection Protects V BUS Very low capacitance: 3 pF Very low leakage current: 10 nA Peak pulse power (8/20 μs): 130 W typ. SOT23-6L package RoHS compliant Datasheet <https://www.st.com/resource/en/datasheet/usblc6-4.pdf>
U1 = microbuilder:EEPROM_I2C_MCP24AA32: Microchip 32K (4K x 8) 1.8V I2C EEPROM SOT23-5 [Digikey: 24AA32AFT-I/OTCT-ND]
X1 = con-wago:EIB
X2 X5 = con-JST PH:B10B-PH: JST PH series header 2.00mm pitch disconnectable crimp style connectors, vertical (side entry type), 10 pins

## Board
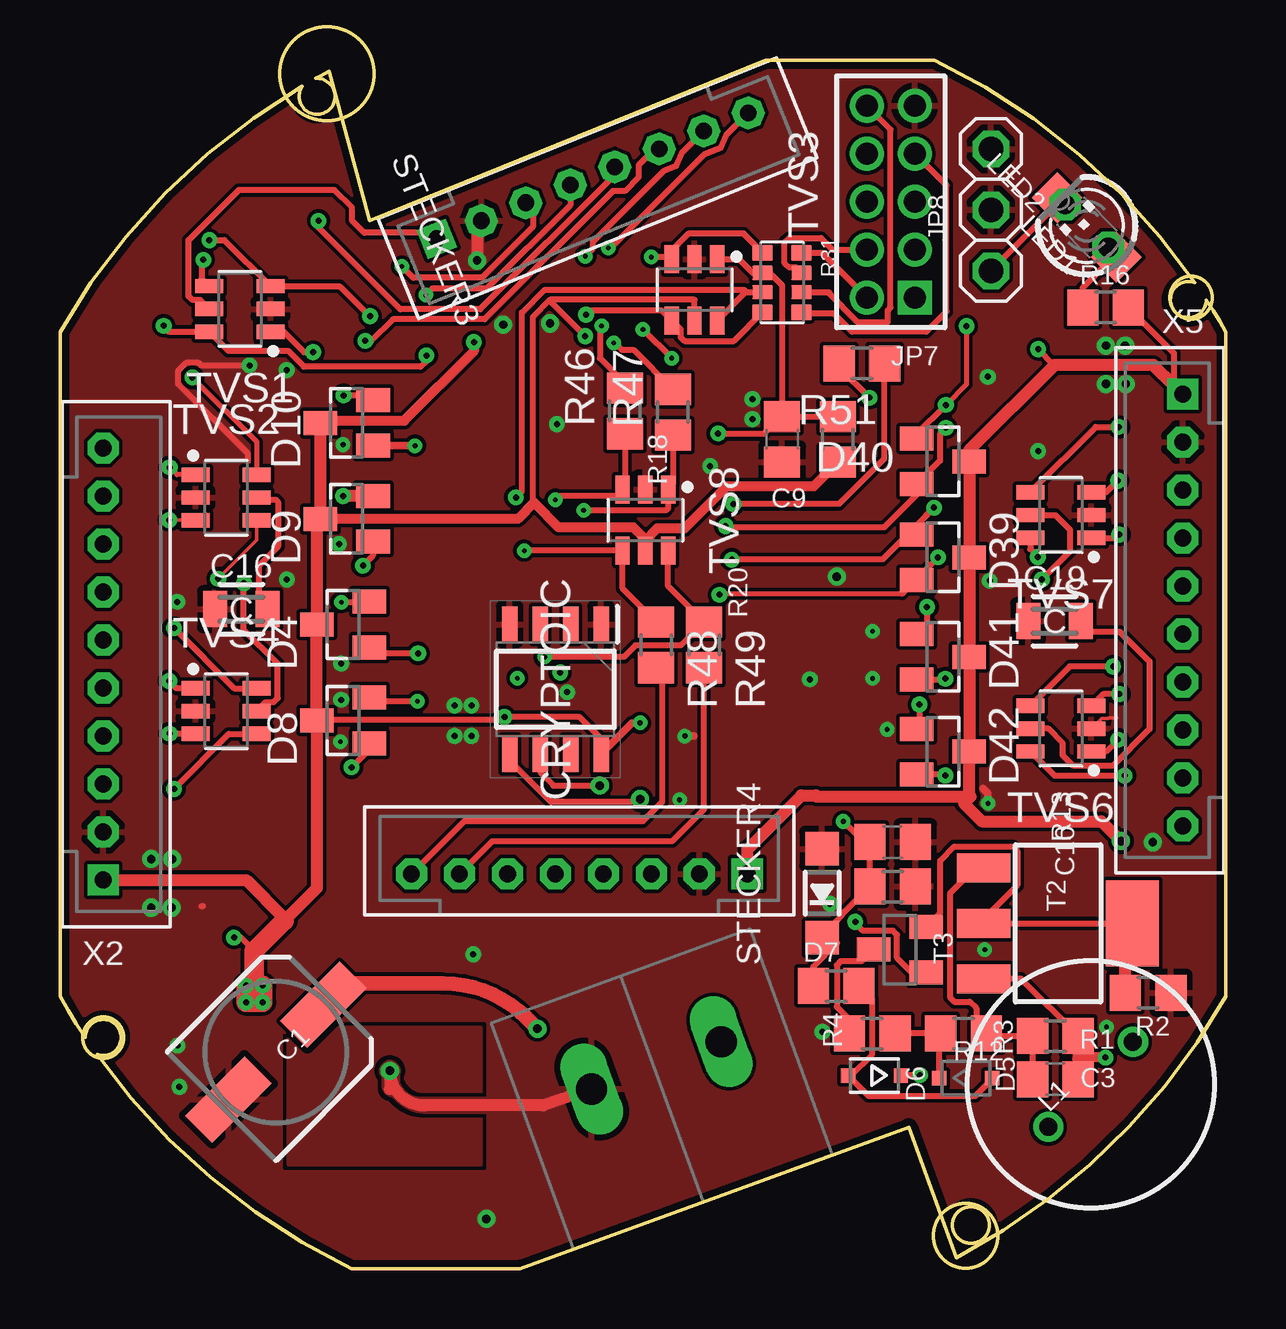
[diagram p3: board, top side]
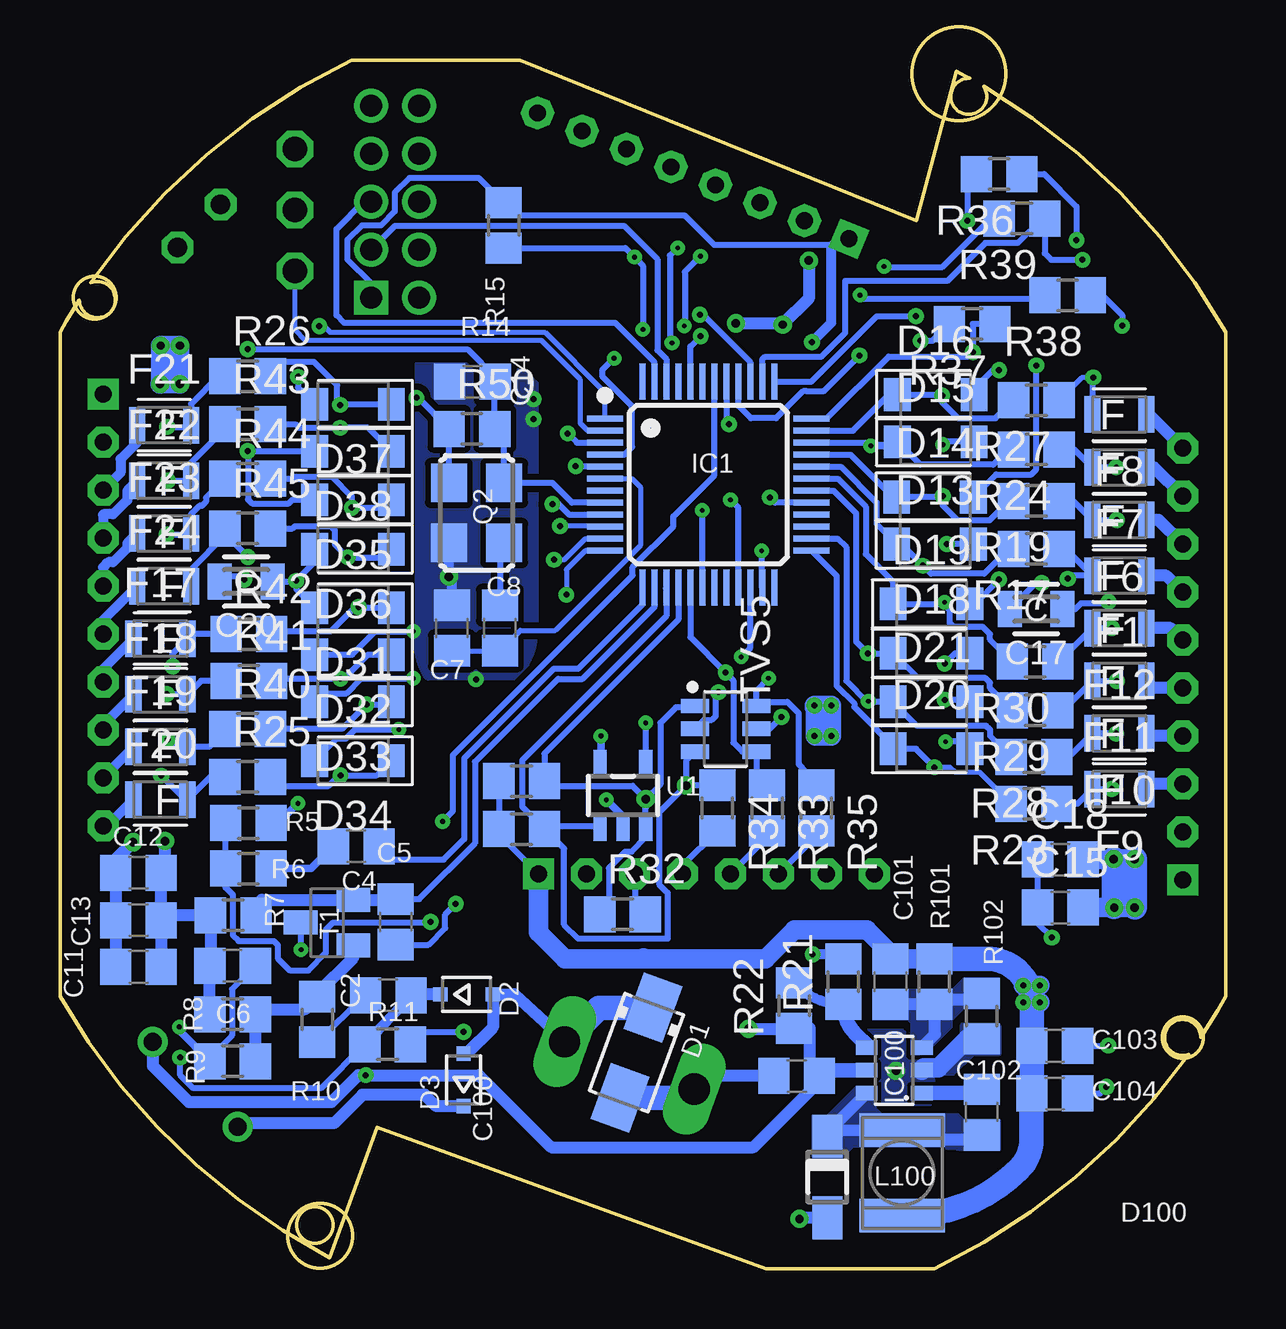
[diagram p4: board, bottom side, seen from below]

Size 48.6 x 50.38 mm. Coordinates in mm from the lower left corner, seen from the top.
Outline: 10.1,49.28 arc30 0,39.04 0,11.34 arc4 1.05,9.64 arc-290 1.54,8.93 arc29 12.15,0 19.18,0 35.38,5.9 37.36,0.46 arc32 48.6,11.34 48.6,39.04 arc3 47.79,40.37 arc-289 47.31,41.09 arc30 36.45,50.38 29.41,50.38 12.91,43.68 11.23,49.92 arc1 10.67,49.61 arc-308 10.1,49.28
Outline: circle at 37.97,1.82 radius 0.75
Copper layers (1*16): Top 0.035mm / dielectric 1.5mm / Bottom 0.035mm
Design rules "default *": minimum track width 6mil, minimum drill 0.2mm, track to track 6mil, track to pad 6mil, pad to pad 6mil, via to via 6mil, smd to smd 6mil, copper to edge 0.3mm, drill to drill 0.3mm, minimum pad ring 10mil, minimum via ring 8mil, stop-mask expansion 4mil, vias tented up to drill 0mil, thermal gap 10mil
Milling: area 1,8.8 to 2.6,10.5; area 9.2,47.9 to 13.1,51.7; area 46.3,39.6 to 48,41.3; area 36.4,0 to 39.1,2.7

### Footprints (pad centres in the part's own frame; a part is rotated, then mirrored left to right if it is on the bottom)
SANYO-OSCON_SMD_C6 = smd 3.5 x 1.6: + 2.8,0; - -2.8,0
C0805 = smd 1.3 x 1.5: 1 -0.95,0; 2 0.95,0
C0805' = smd 1 x 1.5: 1 -1.1,0; 2 1.1,0
SOIC127P600X175-8N = smd 1.5 x 0.65: 1 -2.7,1.905; 2 -2.7,0.635; 3 -2.7,-0.635; 4 -2.7,-1.905; 5 2.7,-1.905; 6 2.7,-0.635; 7 2.7,0.635; 8 2.7,1.905
DO214AC = smd 2.5 x 1.7: A 2,0; C -2,0
SOD323-R = smd 0.6 x 0.6: A 1.1,0; C -1.1,0
SOT23 = smd 1 x 1.4: 1 -0.95,-1.1; 2 0.95,-1.1; 3 0,1.1
SOD-123 = smd 1.4 x 1.4: A 1.85,0; C -1.85,0
SODFL3718X115 = smd 1.115 x 1.361: 1 -1.6,0; 2 1.6,0
SOD123FL = smd 1.8 x 1.25: A 1.7,0; C -1.7,0
F0805 = smd 0.679 x 1.52: 1 -1.125,0; 2 1.125,0
LQFP48 = smd 1.5 x 0.25: 1 -4.3,2.75; 2 -4.3,2.25; 3 -4.3,1.75; 4 -4.3,1.25; 5 -4.3,0.75; 6 -4.3,0.25; 7 -4.3,-0.25; 8 -4.3,-0.75; 9 -4.3,-1.25; 10 -4.3,-1.75; 11 -4.3,-2.25; 12 -4.3,-2.75; 25 4.3,-2.75; 26 4.3,-2.25; 27 4.3,-1.75; 28 4.3,-1.25; 29 4.3,-0.75; 30 4.3,-0.25; 31 4.3,0.25; 32 4.3,0.75; 33 4.3,1.25; 34 4.3,1.75; 35 4.3,2.25; 36 4.3,2.75 | smd 0.25 x 1.5: 13 -2.75,-4.3; 14 -2.25,-4.3; 15 -1.75,-4.3; 16 -1.25,-4.3; 17 -0.75,-4.3; 18 -0.25,-4.3; 19 0.25,-4.3; 20 0.75,-4.3; 21 1.25,-4.3; 22 1.75,-4.3; 23 2.25,-4.3; 24 2.75,-4.3; 37 2.75,4.3; 38 2.25,4.3; 39 1.75,4.3; 40 1.25,4.3; 41 0.75,4.3; 42 0.25,4.3; 43 -0.25,4.3; 44 -0.75,4.3; 45 -1.25,4.3; 46 -1.75,4.3; 47 -2.25,4.3; 48 -2.75,4.3
SOT23-6 = smd 0.6 x 0.9: 1 -0.95,-1.15; 2 0,-1.15; 3 0.95,-1.15; 4 0.95,1.15; 5 0,1.15; 6 -0.95,1.15
2X05M = drill 0.914 square: 1 -4,-1 | drill 0.914: 2 -4,1; 3 -2,-1; 4 -2,1; 5 0,-1; 6 0,1; 7 2,-1; 8 2,1; 9 4,-1; 10 4,1
1X03 = drill 1.016 octagon: 1 -2.54,0; 2 0,0; 3 2.54,0
BS11 = drill 0.75: 1 -2.5,0; 2 2.5,0
L4532P = smd 1.397 x 3.556: 1 -1.778,0; 2 1.778,0
CHIPLED_1206 = smd 1.5 x 1.5: A 0,-1.75; C 0,1.75
LED3MM = drill 0.813 octagon: A -1.27,0; K 1.27,0
ASF = smd 1.6 x 1.5: 1 -1.25,-1.15; 2 1.25,-1.15; 3 1.25,1.15; 4 -1.25,1.15
R0805 = smd 1.3 x 1.5: 1 -0.95,0; 2 0.95,0
YC164-JR-0733RL = smd 0.67 x 0.85: 1 -1.24,-0.81; 4 1.24,-0.81; 5 1.24,0.81; 8 -1.24,0.81 | smd 0.59 x 0.85: 2 -0.4,-0.81; 3 0.4,-0.81; 6 0.4,0.81; 7 -0.4,0.81
B8B-PH-K-S = drill 0.7 pad 1.3 square: 1 7,0 | drill 0.7 pad 1.3 octagon: 2 5,0; 3 3,0; 4 1,0; 5 -1,0; 6 -3,0; 7 -5,0; 8 -7,0
SOT23-BEC = smd 1 x 1.4: B -0.95,-1.1; C 0,1.1; E 0.95,-1.1
SOT223 = smd 1.219 x 2.235: 1 -2.311,-3.099; 2 0,-3.099; 3 2.311,-3.099 | smd 3.6 x 2.2: 4 0,3.099
SOT-23-6L = smd 1.165 x 0.597: 1 -1.275,0.95; 2 -1.275,0; 3 -1.275,-0.95; 4 1.275,-0.95; 5 1.275,0; 6 1.275,0.95
SOT23-5 = smd 0.55 x 1.2: 1 -0.95,-1.3; 2 0,-1.3; 3 0.95,-1.3; 4 0.95,1.3; 5 -0.95,1.3
BUSKLEMME243-724 = drill 1.3 long: 1 -2.875,0; 2 2.875,0
B10B-PH-K-S = drill 0.7 pad 1.3 square: 1 9,0 | drill 0.7 pad 1.3 octagon: 2 7,0; 3 5,0; 4 3,0; 5 1,0; 6 -1,0; 7 -3,0; 8 -5,0; 9 -7,0; 10 -9,0

### Placement (x,y rotation side)
C1  9,9.03 45 top
C2  34.91,11.4 180 bottom
C3  41.49,7.9 180 top
C4  36.25,17.6 0 bottom
C5  34.6,14.45 90 bottom
C6  41.4,12.62 180 bottom
C7  32.26,26.7 270 bottom
C8  30.26,26.7 90 bottom
C9  30.1,34.57 90 top
C10  34.71,17.78 180 top
C11  45.33,12.58 0 bottom
C12  45.33,16.5 0 bottom
C13  45.33,14.53 0 bottom
C14  31.4,36.97 0 bottom
C15  6.9,15.05 0 bottom
C16  100nF  [C0805']  7.56,27.49 0 top
C17  100nF  [C0805']  7.91,27.49 180 bottom
C18  6.9,17.05 0 bottom
C19  100nF  [C0805']  41.46,26.99 0 top
C20  100nF  [C0805']  40.84,28.64 180 bottom
C100  17.89,8.03 0 bottom
C101  13.98,11.97 90 bottom
C102  10.17,6.52 90 bottom
C103  7.13,9.29 0 bottom
C104  7.13,7.3 0 bottom
CRYPTOIC  20.65,24.15 270 top
D1  24.57,9 250 bottom
D2  31.65,11.43 0 bottom
D3  31.77,7.87 90 bottom
D4  11.8,26.85 90 top
D5  37.75,7.95 0 top
D6  33.95,8.05 180 top
D7  31.77,15.66 90 top
D8  11.8,22.85 90 top
D9  11.95,31.25 90 top
D10  11.95,35.25 90 top
D13  12.12,30.2 0 bottom
D14  12.12,32.16 0 bottom
D15  12.09,34.47 0 bottom
D16  12.09,36.43 0 bottom
D18  12.27,25.65 0 bottom
D19  12.27,27.71 0 bottom
D20  12.27,21.67 0 bottom
D21  12.27,23.63 0 bottom
D31  36.38,27.55 180 bottom
D32  36.38,25.59 180 bottom
D33  36.38,23.63 180 bottom
D34  36.38,21.17 180 bottom
D35  36.38,32.05 180 bottom
D36  36.38,29.99 180 bottom
D37  36.38,36.03 180 bottom
D38  36.38,34.07 180 bottom
D39  36.8,29.65 270 top
D40  36.8,33.65 270 top
D41  36.8,25.5 270 top
D42  36.8,21.55 270 top
D100  16.61,3.82 270 bottom
F1  4.45,28.89 180 bottom
F6  4.45,31.21 180 bottom
F7  4.45,33.4 180 bottom
F8  4.45,35.6 180 bottom
F9  4.45,19.99 180 bottom
F10  4.45,22.31 180 bottom
F11  4.45,24.5 180 bottom
F12  4.45,26.7 180 bottom
F17  44.41,26.26 0 bottom
F18  44.41,23.94 0 bottom
F19  44.41,21.75 0 bottom
F20  44.41,19.55 0 bottom
F21  44.26,35.16 0 bottom
F22  44.26,32.84 0 bottom
F23  44.26,30.65 0 bottom
F24  44.26,28.45 0 bottom
IC1  21.57,32.68 0 bottom
IC100  13.82,8.27 90 bottom
JP7  34.63,44.47 90 top
JP8  38.81,44.13 90 top
L1  42.96,7.68 45 top
L100  13.5,3.99 270 bottom
LED1  42.8,43.4 45 top
LED2  42.8,43.46 135 top
Q2  31.23,31.5 270 bottom
R1  41.49,9.7 180 top
R2  45.36,11.5 180 top
R3  37.66,9.8 0 top
R4  33.86,9.8 0 top
R5  40.74,18.57 0 bottom
R6  40.74,16.68 0 bottom
R7  41.38,14.73 180 bottom
R8  41.4,10.6 180 bottom
R9  41.4,8.65 0 bottom
R10  37.87,10.39 90 bottom
R11  34.94,9.35 180 bottom
R12  32.36,11.78 180 top
R13  34.71,15.93 0 top
R14  32.43,34.57 270 top
R15  30.1,43.48 90 bottom
R16  43.58,40.06 0 top
R17  7.9,30 180 bottom
R18  29.35,18.32 180 bottom
R19  7.9,32 180 bottom
R20  29.35,20.32 180 bottom
R21  15.95,11.97 90 bottom
R22  18,10.97 90 bottom
R23  8,19.38 180 bottom
R24  7.9,34.15 180 bottom
R25  40.78,20.5 0 bottom
R26  40.78,37.2 0 bottom
R27  7.9,36.2 180 bottom
R28  8,21.32 180 bottom
R29  7.95,23.28 180 bottom
R30  7.95,25.3 180 bottom
R31  30.1,41.1 270 top
R32  25.15,14.78 0 bottom
R33  19.12,19.2 270 bottom
R34  21.2,19.2 270 bottom
R35  17.07,19.2 270 bottom
R36  9.45,45.62 180 bottom
R37  10.57,39.38 180 bottom
R38  6.6,40.57 180 bottom
R39  8.5,43.77 180 bottom
R40  40.78,22.5 0 bottom
R41  40.73,24.5 0 bottom
R42  40.73,26.45 0 bottom
R43  40.78,35.2 0 bottom
R44  40.78,32.92 0 bottom
R45  40.78,30.85 0 bottom
R46  23.55,35.75 90 top
R47  25.55,35.7 90 top
R48  24.85,26 270 top
R49  26.85,26 270 top
R50  31.43,35 0 bottom
R51  33.43,37.72 180 top
R101  12.15,11.97 90 bottom
R102  10.18,10.53 90 bottom
STECKER3  22.2,45.55 202 top
STECKER4  21.65,16.45 0 top
T1  37.46,14.43 90 bottom
T2  41.6,14.39 270 top
T3  35.01,13.3 90 top
TVS1  7.5,40 180 top
TVS2  6.93,32.14 0 top
TVS3  26.45,40.8 270 top
TVS4  6.93,23.24 0 top
TVS5  20.85,22.5 0 bottom
TVS6  41.72,22.51 180 top
TVS7  41.72,31.41 180 top
TVS8  24.4,31.2 270 top
U1  25.13,19.73 0 bottom
X1  24.86,8.47 20 top
X2  1.8,25.2 270 top
X5  46.8,27.45 90 top

### Tracks (layer width: path | path; a pad name or v marks a point on that pad's centre or on a via)
+3V3  (via drill 0.2, 0.25, 0.35)
  Top 0.254: D40.3 37.75,33.8 | TVS3.5 26.45,40.39 20.44,40.39 | 20.44,40.39 19.7,39.65 19.7,31.99 19.76,31.93 | 5.75,40 TVS1.5 5.85,40.37 5.53,40.37 5.36,40.54 5.36,42.87 7.45,44.96 11.45,44.96 12.17,44.23 12.17,43.69 12.68,43.18 15.46,43.18 STECKER3.1 | 24.4,30.4 TVS8.5 | CRYPTOIC.8 22.55,22.1 21.66,22.99 v18.52,22.99 18.4,22.87 10.72,22.87 D8.3 | v7.25,13.8 7.55,13.8 8.1,13.25 | R16.2 46.43,38.16 46.43,36.82 | v40.78,38.33 41.44,37.67 41.46,37.67 | v21.89,38.87 20.44,40.33 20.44,40.39
  Top 0.305: CRYPTOIC.8 23.85,22.75 v24.18,22.75
  Top 0.406: D10.3 10.94,35.34 14.35,35.34 17.25,38.25 v17.25,38.62 | D9.3 19.08,31.25 19.76,31.93 20.79,30.9 23.9,30.9 24.4,30.4 | TVS8.5 24.4,30.36 24.9,30.86 26.05,30.86 27.8,32.61 31.42,32.61 R14.2
  Top 0.508: D10.3 D9.3 10.7,31.1 D4.3 D8.3 10.7,15.85 9.35,14.5 9.35,14.6 7.75,16.2 X2.1 1.9,16.1 | D41.3 D39.3 D40.3 37.9,34.11 41.46,37.67 45.58,37.67 46.43,36.82 X5.1 | D41.3 D42.3 | D42.3 37.69,21.34 | 37.86,25.54 D41.3 | 28.65,16.15 STECKER4.1 28.65,17.48 30.9,19.73 31.5,19.73 31.55,19.68 37.96,19.68 37.9,19.61 | 37.9,19.61 D42.3 | 37.9,19.61 37.68,19.39 38.43,18.65 43.4,18.65 v44.23,17.82
  Top 0.813: v7.75,11.1 8.1,11.45 8.1,13.25 9.35,14.5 | 8.3,11.8 v7.75,11.8 v7.75,11.1 | v8.45,11.8 v8.45,11.1 v7.75,11.1
  Bottom 0.254: v24.18,22.75 U1.4 | IC1.8 27.26,31.93 28.07,32.75 Q2.4 30.08,34.6 R50.2 30.47,36.95 C14.2 30.45,37.17 31.58,38.3 40.75,38.3 v40.78,38.33 | JP7.1 | JP7.1 35.63,41.07 36.62,42.06 36.62,42.88 36.02,43.48 35.22,43.48 34.64,44.06 34.64,44.86 34.04,45.46 31.13,45.46 R15.2 29.57,43.91 22.56,43.91 21.33,42.68 16.36,42.68 | R20.2 R18.2 30.3,18.1 STECKER4.1 | C18.1 C15.1 7.85,14.4 v7.25,13.8 | TVS5.5 19.02,22.5 v18.52,22.99 | IC1.44 22.32,38.12 22.32,38.44 v21.89,38.87
  Bottom 0.406: STECKER3.1 16.11,42.93 16.36,42.68 16.46,42.58 16.46,39.41 v17.25,38.62 | C104.1 C103.1
  Bottom 0.508: R7.2 42.73,15.12 | R7.2 42.33,15.07 | R7.2 42.53,14.92 | R8.2 C6.2 42.33,12.65 R7.2 | R7.2 42.38,14.68 | v44.23,17.82 44.23,16.65 C12.2 C13.2 | R7.2 44.18,14.73 C13.2 | C13.2 C11.2
  Bottom 0.813: R101.2 C101.2 13.98,13.14 14.97,14.13 17.98,14.13 19.19,12.92 24.2,12.92 24.28,12.95 24.35,12.92 27.55,12.92 28.65,14.02 STECKER4.1 | v7.75,11.8 v8.45,11.8 | v7.75,11.1 8.01,11.1 8.08,11.03
  Bottom 1.016: 12.8,2.31 12.9,2.21 L100.2 13.29,2.21 arc-45 8.62,4.14 arc-45 8.11,5.39 8.11,7.27 C104.1 | C103.1 8.08,8.08 | C103.1 | C103.1 8.08,11.03 arc-90 9.97,12.92 R101.2
ARGL
  pour Top (isolate 0.254, no thermals): 17.57,10.06 9.5,10.06 9.5,4.33 17.57,4.33
BST
  Bottom 0.508: 10.32,7.32 arc90 C102.2
  Bottom 0.61: IC100.1 10.32,7.32
BUS_V  (via drill 0.2)
  Top 0.254: R12.2 31.4,12.58 32.4,13.57 D7.C 32.7,14.87 R13.1 C10.2 33.51,17.78 v32.65,18.64
  Bottom 0.254: v32.65,18.64 32.23,19.07 32.23,21.39 24.72,28.89 24.72,29.25 23.03,30.94 23.03,31.35 21.32,33.06 IC1.42
EIB+
  Bottom 0.508: X1.2 28.4,10.3 29.66,11.43 D2.A 30.55,10.06 31.64,8.97 D3.A
  Bottom 1.016: D1.C 26.14,10.88 X1.2
EIB+DIR  (via drill 0.25)
  Top 0.254: R1.1 40.06,12.08 T2.3 | 42.49,8.8 42.44,8.75
  Top 0.406: v43.58,8.8 42.49,8.8
  Top 0.508: 42.4,7.86 C3.1 42.44,8.75 R1.1
  Bottom 0.254: R11.2 37.72,7.52 43.04,7.52 43.58,8.06 v43.58,8.8
  Bottom 0.406: R11.2 C2.1
  Bottom 0.508: 33.57,11.4 C2.1 33.93,11.43 D2.C 32.8,11.38 32.89,11.38
EIB_DC  (via drill 0.25, 0.35)
  Top 0.254: v35.85,8.07 35.07,8.07 D6.C
  Top 0.61: C1.+ 11.86,11.89 15.99,11.89 arc-45 19.45,10.45 v19.9,10
  Bottom 0.254: 17,8.27 17.05,8.22 17.05,8.14 arc90 C100.2
  Bottom 0.508: L1.2 44.73,8.45 43.22,6.95 37.28,6.95 36.16,8.07 v35.85,8.07 31.13,8.07 28.13,5.06 19.69,5.06 16.94,7.81 C100.2 arc90 17.35,8.44 17.35,10.02 R22.1 18.02,10 v19.9,10
  Bottom 0.61: IC100.5 17,8.27
EIB_IN
  Bottom 0.254: R7.1 40.5,14.65 | C5.2 33.62,15.4 31.3,17.73 31.3,21.12 27.84,24.59 26.81,24.59 23.8,27.6 23.8,28.36 IC1.14
  Bottom 0.508: R7.1 40.43,15.12 40.18,15.38 T1.E 34.62,15.38 C5.2
EIB_OUT
  Bottom 0.254: IC1.13 24.32,27.68 27,25 28.02,25 31.75,21.27 31.75,17.9 32.6,17.05 34.75,17.05 C4.2
FB
  Bottom 0.508: R101.1 11.94,11.23 10.43,11.23 R102.2 | R101.1 C101.1 | IC100.3 12.12,9.77 12.12,10.99 R101.1
  pour Bottom (no thermals): 13.12,8.93 12.22,8.93 12.22,9.28 11.42,10.08 11.42,10.35 10.92,10.85 9.45,10.85 9.45,12.1 10.92,12.1 11.38,11.65 11.4,11.65 11.42,11.62 14.7,11.62 14.7,10.43 14.72,10.4 13.27,10.4 13.25,10.38 13.12,10.25
GND  (via drill 0.2, 0.25, 0.35)
  Top 0.152: TVS6.2 43.42,22.93 43.67,22.93 43.69,22.95 44.05,22.95
  Top 0.254: 5.9,15.1 5.95,15.1 | v7.9,37.65 5.88,37.65 5.77,37.76 5.27,37.76 4.91,37.4 4.91,36.9 7.83,33.98 7.83,33.67 | v31.78,9.87 31.98,9.87
  Top 0.305: v26.05,22.2 26.42,22.2 | v38.68,19.39 38.68,19.82 38.48,20.03
  Top 0.508: STECKER3.2 17.38,43.5 v17.38,42.02 | 13.75,7.49 v13.75,8.25 arc90 15.2,6.8 20.15,6.8 X1.1
  Bottom 0.254: v38.68,37.17 38.68,36.72 D37.2 | D38.2 v40.78,34.07 40.75,34.05 40.75,32.06 40.59,31.9 39.06,31.9 38.91,32.05 D35.2 | C20.1 38.79,28.64 v38.75,28.68 | v38.75,28.68 37.98,29.45 D36.2 | v38.75,28.68 38.75,28.32 D31.2 | D33.2 37.63,23.98 36.66,23.98 36.04,24.6 v33.87,24.6 | D32.2 36.41,25.59 35.45,26.55 33.9,26.55 v33.88,26.57 | D34.2 37.06,22.09 36.68,22.09 36.3,22.48 v34.48,22.48 | C104.2 5.25,7.3 v4.98,7.58 | C103.2 v4.91,9.29 v4.9,9.3 | 32.38,30.2 Q2.2 | IC1.5 27.08,33.43 v27.1,33.45 | v32.1,15.2 32.54,14.76 32.54,14.2 33.24,13.5 C5.1 | IC1.41 20.82,35.31 v20.71,35.2 | T1.C 38.56,13.31 v38.55,13.3 | C6.1 41.42,11.65 41.42,9.73 42.35,8.81 R9.1 | D15.2 11.68,34.47 v11.8,34.35 | D20.2 10.96,21.96 v11.68,21.96 | D16.2 10.49,36.66 9.7,37.45 v9.45,37.45 | D14.2 9.58,33.1 8.1,33.1 7.92,33.28 7.92,37.63 v7.9,37.65 | D13.2 v11.62,30.2 | C17.1 6.28,27.49 6.03,27.74 4.94,27.74 v4.89,27.8 | TVS5.2 21.75,22.87 21.43,22.87 21.26,23.04 21.26,23.91 v21.14,24.03 | R11.1 33.47,9.87 v31.78,9.87 | D21.2 10.75,23.71 v11.72,23.71 | D18.2 11.29,25.65 v11.72,25.23 | D19.2 10.47,27.71 v9.46,28.72
  Bottom 0.305: R9.1 43.62,9.92 v43.62,10.08 | U1.2 25.13,18.85 v25.82,19.54 | U1.5 26.05,21.06 v26.05,22.2 | R5.2 39.5,18.57 v38.68,19.39
  Bottom 0.406: C7.1 32.26,28.72 v32.38,28.85 32.38,30.2 | R21.2 16.13,13.1 v17.22,13.1
  Bottom 0.508: C11.1 C13.1 C12.1 46.28,17.05 v45.55,17.78 | D100.A 17.73,2.12 v17.77,2.07 | v17.38,42.02 17.38,40.44 v18.47,39.35 18.52,39.4 v20.43,39.4 | C100.1 21.62,8.03 X1.1
  Bottom 0.813: C15.2 v4.65,15.05 | C18.2 4.7,17.05 v4.67,17.07 v3.8,17.07 | 4.67,15.08 v4.65,15.05 | v3.8,15.05 v4.65,15.05 | v16.45,23.48 v16.45,22.2 17.11,22.2 | 17.11,22.2 17.11,23.36 17.15,23.39 v17.15,23.48 16.52,23.48 16.45,23.41 16.45,22.86 17.11,22.2 | v44.43,36.88 44.4,36.9 | 44.4,36.9 v44.4,38.47 v43.6,38.47 v43.6,36.88 43.62,36.9 44.4,36.9 | IC100.2 12.58,8.36 11.99,8.36 10.77,9.58 R102.1
  Bottom 1.016: D1.A 22.52,7.12 X1.1 | v4.67,17.07 4.67,15.08 | v3.8,15.05 v3.8,17.07
  other vias: 28.86,35.42 17.15,22.2 31.26,24.57 28.86,36.24
  pour Top (rank 4): 0,39.04 0,11.34 arc4 1.05,9.64 arc-290 1.54,8.93 arc29 12.15,0 19.18,0 35.38,5.9 37.36,0.46 arc32 48.6,11.34 48.6,39.04 arc3 47.79,40.37 arc-289 47.31,41.09 arc30 36.45,50.38 29.41,50.38 12.91,43.68 11.23,49.92 arc1 10.67,49.61 arc-308 10.1,49.28 arc30
  pour Bottom (isolate 0.254, no thermals): 28.7,26.63 arc45 29.56,24.55 33.21,24.55 arc45 33.38,24.62 arc45 33.75,26.85 33.75,37.75 arc45 33.75,37.75 30.65,37.75 arc45 28.7,36.94
  pour Bottom (no thermals): 15.6,7.8 15.6,9.45 15.62,9.48 15.12,9.98 13.47,9.98 13.38,9.88 13.38,8.83 13.22,8.68 12.15,8.68 11.05,9.78 11.05,10.15 10.97,10.23 9.5,10.23 9.4,10.12 9.4,8.95 9.45,8.9 10.52,8.9 11.35,8.08 12.07,8.08 12.17,7.98 12.17,6.95 12.32,6.8 14.27,6.8 14.32,6.85 14.32,7.8
  pour Top (isolate 0.254, rank 2, no thermals): 17.55,10.13 9.47,10.13 9.47,4.33 17.55,4.33
IN1
  Bottom 0.508: X2.3 3.11,20.2 F9.1
IN2
  Bottom 0.508: X2.4 3.21,22.2 F10.1
IN3
  Bottom 0.508: X2.5 3.02,24.2 F11.1
IN4
  Bottom 0.508: X2.6 2.3,26.7 F12.1
IN5
  Bottom 0.508: X2.7 2.49,28.89 F1.1
IN6
  Bottom 0.508: X2.8 2.81,31.21 F6.1
IN7
  Bottom 0.508: X2.9 3,33.4 F7.1
IN8
  Bottom 0.508: X2.10 3.2,35.6 F8.1
IN9
  Bottom 0.406: X5.3 46.08,33.17 46.08,33.75 45.38,34.44 F21.1
IN10
  Bottom 0.406: X5.4 46.8,31.42 46.78,31.44 46.38,31.44 45.79,32.03 45.79,32.43 F22.1
IN11
  Bottom 0.406: X5.5 46.8,29.23 46.59,29.44 46.38,29.44 45.79,30.03 45.79,30.24 F23.1
IN12
  Bottom 0.406: X5.6 46.8,27.03 46.39,27.44 46.38,27.44 45.79,28.03 45.79,28.04 F24.1
IN13
  Bottom 0.406: F17.1 46.8,24.99 X5.7
IN14
  Bottom 0.406: F18.1 46.8,22.67 X5.8
IN15
  Bottom 0.406: X5.9 46.8,20.48 F19.1
IN16
  Bottom 0.406: F20.1 46.63,18.45 X5.10
IN200  (via drill 0.2)
  Top 0.254: STECKER3.4 21.27,44.33 17.79,40.85 15.52,40.85 v15.25,40.58
  Bottom 0.254: v15.25,40.58 15.09,40.42 7.7,40.42 R38.2
IN201  (via drill 0.2)
  Top 0.254: STECKER3.3 19.72,44.13 19.72,43.42 17.59,41.3 14.72,41.3 v14.25,41.77
  Bottom 0.254: v14.25,41.77 14.22,41.75 11.82,41.75 9.8,43.77 R39.2
IN_MISO1
  Bottom 0.254: STECKER4.6 17.54,17.56 R35.2
IN_MOSI1
  Bottom 0.254: 20.4,16.45 STECKER4.5 19.12,17.98 R33.2
IO3  (via drill 0.25)
  Top 0.254: D8.1 12.9,21.65 v12.15,20.9
  Bottom 0.2: v12.15,20.9 11.49,20.9 11.28,20.69 10.26,20.69 R23.2
  Bottom 0.254: v12.15,20.9 12.92,21.67 D20.1 | D20.1 13.87,21.82 | IC1.25 16.23,28.89 16.23,24.3 15.49,23.56 15.49,23.41 13.87,21.8 D20.1
IO4  (via drill 0.2)
  Top 0.254: v14.9,23.65 13.05,23.65 D8.2
  Bottom 0.254: D21.1 13.57,23.93 | R28.2 9.83,22.21 9.83,22.47 10,22.63 12.87,22.63 D21.1 | D21.1 14.88,23.63 | 14.88,23.63 v14.9,23.65 | 14.88,23.63 14.94,23.63 15.82,24.51 15.82,30.07 16.18,30.43 IC1.26
IO5  (via drill 0.25)
  Top 0.254: v14.92,25.65 13.15,25.65 D4.1
  Bottom 0.254: IC1.30 16.35,32.43 15.41,31.5 15.41,26.14 v14.92,25.65 D18.1 12.84,24.62 10.02,24.62 9.83,24.43 9.83,24.21 R29.2
IO6  (via drill 0.2)
  Top 0.254: D4.2 12.88,27.78 v11.72,27.78
  Bottom 0.254: 11.79,27.71 D19.1 13.87,28.64 15.01,29.78 15.01,31.76 16.18,32.93 IC1.31 | 11.79,27.71 v11.72,27.78 | R30.2 9.83,26.23 9.83,26.45 10.14,26.75 11.34,26.75 11.51,26.91 11.51,27.43 11.79,27.71
IO17/SCL  (via drill 0.35)
  Top 0.254: CRYPTOIC.6 20.02,20.69 20.57,20.13 v22.5,20.13
  Bottom 0.254: R18.1 28.3,18.43 U1.1 26.18,18.32 | R18.1 29.33,19.26 29.33,21.19 23.32,27.2 IC1.15 23.34,28.36 | v22.5,20.13 22.5,21.18 TVS5.3 | v22.5,20.13 23.63,19.01 23.63,16.02 23.27,15.67 23.27,13.75 26.99,13.75 27.58,14.33 27.58,17.5 R18.1 | R34.1 22.48,20.15 v22.5,20.13
IO18/SDA  (via drill 0.35)
  Top 0.254: CRYPTOIC.5 18.75,21.18 20.47,19.45 24.11,19.45 24.18,19.52 v24.18,19.57
  Bottom 0.254: U1.3 v24.18,19.57 | 26.1,14.94 R32.1 25.72,15.15 25.72,16.69 25.04,17.38 24.77,17.38 24.18,17.97 U1.3 | IC1.16 22.82,27.05 28.4,21.47 R20.1 28.2,20.12 24.73,20.12 v24.18,19.57 | U1.3 24.18,19.2 | TVS5.1 22.18,23.4 22.93,23.4 23.57,22.75 23.57,20.18 v24.18,19.57
IO19  (via drill 0.2)
  Top 0.254: R47.1 25.55,32.7 25.35,32.5 TVS8.1 25.35,31.7 25.26,31.61 v21.82,31.61
  Bottom 0.254: IC1.18 v21.82,31.6 v21.82,31.61
IO20  (via drill 0.2)
  Top 0.254: R46.1 23.55,32.57 TVS8.3 23.18,32.2 20.8,32.2 v20.65,32.05
  Bottom 0.254: v20.65,32.05 20.32,31.72 IC1.21
IO21  (via drill 0.2)
  Top 0.254: TVS8.6 25.35,28.45 R49.1 25.88,25.98 23.98,25.98 23.5,25.5 v20.2,25.5
  Bottom 0.254: v20.2,25.5 19.82,25.88 IC1.22
IO22  (via drill 0.2)
  Top 0.254: R48.1 23.45,28.35 TVS8.4 v19.35,29.93
  Bottom 0.254: v19.35,29.93 19.35,28.41 IC1.23
IO107  (via drill 0.25)
  Top 0.254: D9.1 13.05,29.73 v12.62,29.3
  Bottom 0.2: IC1.32 17.3,33.46
  Bottom 0.254: R17.2 9.04,30 10.07,28.96 12.29,28.96 v12.62,29.3 13.52,30.2 D13.1 14.56,31.04 14.56,31.94 16.05,33.43 IC1.32
IO108  (via drill 0.25)
  Top 0.254: 12.55,32.2 D9.2
  Top 0.508: D9.2 v11.8,32.2
  Bottom 0.254: R19.2 9.05,32 9.85,31.2 11.19,31.2 11.8,31.81 v11.8,32.2 11.84,32.16 D14.1 13.87,32.16 15.64,33.93 IC1.33
IO109  (via drill 0.2)
  Top 0.305: D10.1 v14.8,34.3
  Bottom 0.2: IC1.34 17.24,34.4
  Bottom 0.254: D15.1 13.45,34.22 | R24.2 9.06,34.15 9.7,33.51 12.73,33.51 D15.1 | 13.91,34.68 D15.1 | v14.8,34.3 14.93,34.43 IC1.34
  Bottom 0.305: D15.1 13.86,34.3 v14.8,34.3
IO110  (via drill 0.25)
  Top 0.254: D10.2 12.85,36.4 v11.82,36.4
  Bottom 0.2: 8.85,36.15 R27.2
  Bottom 0.254: IC1.35 15.54,34.93 14.04,36.43 D16.1 11.85,36.43 v11.82,36.4 11.82,36.1 11.17,35.45 9.6,35.45 R27.2
IO113  (via drill 0.25)
  Top 0.2: 35.52,30.78 D39.1
  Top 0.254: D39.1 35.7,30.98 v36.43,31.71 34.29,29.57 28.02,29.57 v28,29.55
  Bottom 0.2: IC1.11 26.69,30.43 27.57,29.55 v28,29.55
  Bottom 0.254: D35.1 35.12,31.71 v36.43,31.71 36.43,32.19 37.26,33.01 38.8,33.01 38.89,32.92 R44.2
IO114  (via drill 0.25)
  Top 0.2: D39.2 35.11,28.11 27.51,28.11 v27.49,28.09
  Top 0.254: v36.6,29.65 35.7,28.75 D39.2
  Bottom 0.2: v27.49,28.1 v27.49,28.09 27.49,29.14 26.7,29.93 IC1.12
  Bottom 0.254: D36.1 35.13,29.64 v36.59,29.64 v36.6,29.65 37.14,30.19 37.14,30.79 37.31,30.95 38.8,30.95 38.9,30.85 R45.2
IO115  (via drill 0.25)
  Top 0.2: D40.1 35.5,34.8 | v37.79,39.29 37.79,36.87 v36.92,36
  Top 0.254: v36.92,36 35.7,34.78 D40.1
  Bottom 0.2: 26.48,35.43 IC1.1 25.87,36.52 28.39,39.04 37.34,39.04 37.59,39.29 v37.79,39.29
  Bottom 0.254: D37.1 36.9,36.03 v36.92,36 37.04,36.12 37.04,36.83 38.02,37.8 39.23,37.8 R26.2
IO116  (via drill 0.25)
  Top 0.254: v27.75,30.95 27.8,30.9 34.35,30.9 36.05,32.6 35.8,32.6 D40.2 36.68,33.68 36.68,34.8 v36.93,35.05
  Bottom 0.2: IC1.10 25.89,30.95 v27.75,30.95
  Bottom 0.254: R43.2 38.78,35.2 38.63,35.05 v36.93,35.05 35.76,35.05 D38.1
IO117  (via drill 0.25)
  Top 0.254: v36.15,27.57 36.15,26.89 D41.1
  Bottom 0.254: D31.1 36.12,27.55 v36.15,27.57 36.3,27.57 37.3,26.57 39.65,26.57 R42.2
IO118  (via drill 0.25)
  Top 0.254: v36.91,24.59 36.87,24.55 D41.2
  Bottom 0.254: D32.1 35.76,25.59 36.76,24.59 v36.91,24.59 v36.92,24.6 39.68,24.6 R41.2
IO119  (via drill 0.25)
  Top 0.254: v35.83,23.52 35.83,22.62 D42.1
  Bottom 0.254: D33.1 34.89,23.52 v35.83,23.52 36.85,22.5 R40.2
IO120  (via drill 0.25)
  Top 0.254: v36.91,20.56 36.87,20.6 D42.2
  Bottom 0.254: R25.2 39.45,20.12 37.39,20.12 36.96,20.56 v36.91,20.56 35.39,20.56 D34.1
IO200  (via drill 0.25)
  Top 0.254: v5.98,42.05 5.9,41.97 5.9,41.27 TVS1.4
  Bottom 0.254: v5.98,42.05 7.28,42.05 7.55,42.32 R39.1 7.66,43.77 8.68,42.75 10.03,42.75 11.61,41.16 15.88,41.16 15.88,39 16.86,38.01 19.21,38.01 19.32,37.9 IC1.38
IO201  (via drill 0.25)
  Top 0.254: v4.33,39.3 4.33,39.27 4.55,39.05 TVS1.6 7.02,38.26 9.5,38.26 10.17,37.59 15.03,37.59 15.27,37.84 v15.27,38.07
  Bottom 0.254: R38.1 5.15,40.57 4.33,39.75 v4.33,39.3 | v15.27,38.07 16.78,36.56 17.45,36.56 17.46,36.57 17.62,36.57 18.75,35.45 19.8,35.45 20.32,35.97 IC1.40
ISP_EN  (via drill 0.2)
  Top 0.254: R31.1 28.5,43.15 26.2,43.15 25.5,42.45 TVS3.3 25.41,42.16 v24.65,42.16 | v24.3,39.15 v25.5,37.95
  Bottom 0.254: IC1.4 25.07,33.93 24.75,34.25 24.75,35.95 26,37.2 26,37.45 v25.5,37.95 | v24.3,39.15 24.3,41.81 v24.65,42.16 25.02,42.54 R15.1
ISP_RXD
  Bottom 0.254: JP7.3 34.63,43.47 25.09,43.47 23.7,42.07 23.7,38.28 23.32,37.91 IC1.46
ISP_TXD
  Bottom 0.254: IC1.47 23.82,37.79 25.44,39.42 36.75,39.42 37.07,39.74 37.07,43.33 35.93,44.47 JP7.5
LX
  Bottom 0.508: IC100.6 16.69,5.6 arc-90 D100.C 16.35,5.78 L100.1 13.13,5.4 10.34,5.4 C102.1
  pour Bottom (no thermals): 10.95,6.22 9.45,6.22 9.42,6.2 9.42,4.92 10.9,4.92 arc13 11.32,4.97 11.6,4.97 11.7,5.08 15.55,5.08 15.97,4.65 17.2,4.65 17.22,4.67 17.22,6.4 16.6,6.4 15.45,7.55 14.6,7.55 14.6,6.62 14.52,6.62 14.35,6.45 11.17,6.45
MISO1  (via drill 0.2)
  Top 0.254: v19.06,24.61
  Bottom 0.254: R35.1 17.8,21.04 17.8,23.15 18.27,23.62 19.4,23.62 TVS5.6 19.57,24.1 v19.06,24.61
MOSI1  (via drill 0.25)
  Bottom 0.254: IC1.17 22.32,26.32 v20.85,24.85 20.52,24.53 20.52,21.93 20.15,21.55 TVS5.4 | TVS5.4 20.05,21.55 | TVS5.4 19.57,20.6 R33.1
N$1
  Bottom 0.254: R10.1 35.91,11.4 C2.2
N$2
  Bottom 0.508: L1.1 41.04,6.07 37.18,6.07 35.99,7.25 33.4,7.25 32.91,6.77 D3.C
N$3
  Bottom 0.305: C4.1 38.13,16.68 R6.2
N$5
  Bottom 0.406: R22.2 17.91,11.83 arc-45 R21.1 | IC100.4 14.97,9.32
  Bottom 0.61: 14.97,9.32 15.44,9.79 arc45 R21.1
N$6
  Top 0.254: T3.3 33.42,12.81 32.54,12.81 32.38,12.65 32.38,10.92 32.91,10.38 R4.1
N$7
  Top 0.254: 44.5,13.9 T2.4 T2.2 38.5,14.58 39.9,15.98 39.9,17.43 39.74,17.59 37.27,17.59 36.69,17.02 36.69,14.84 T3.2
  Top 0.508: R2.2 44.41,14.1 T2.4
N$8
  Top 0.254: JP7.7 36.95,45.15 36.95,39.9 36.1,39.05 33.02,39.05 32.26,39.81 30.96,39.81 R31.5
N$9
  Bottom 0.254: 24.6,16.3 24.6,16.4 STECKER4.3 24.62,16.43 24.62,15.2 R32.2
N$10
  Bottom 0.254: Q2.3 30.26,30.07 C8.2
N$11
  Top 0.254: R31.6 32,40.7 | 32,40.7 32.06,40.7 | 32,40.7 33.24,39.46 34.5,39.46 34.5,39.94 34.62,40.06 34.62,47.48 JP7.10
N$12  (via drill 0.25)
  Top 0.254: T3.1 35.5,12.35 34.89,12.96 34.89,13.92 34.73,14.08 33.47,14.08 33.15,14.4 v33.15,14.45
  Bottom 0.254: 33.15,14.48 v33.15,14.45 33.17,14.43 37.21,14.43 37.52,14.12 37.52,13.15 38.25,12.42 39,12.42 39.52,12.94 39.52,13.49 39.69,13.65 41.15,13.65 41.4,13.9 41.4,15.59 41.69,15.89 R6.1 R5.1
N$13
  Top 0.254: JP7.4 32.21,42.47 31.72,42.95 30.4,42.95 30.21,42.76 30.21,41.92 30.4,41.73 30.68,41.73 R31.7
N$14
  Bottom 0.508: T1.B 36.36,12.98 37.87,11.47 R10.2 38.39,10.82 40.24,10.82 R8.1 R9.2
N$15
  Top 0.254: C3.2 R1.2 38.71,9.7 R3.2 38.61,9.89 38.19,10.31 38.19,10.87 37.93,11.13 37.28,11.13 37.1,11.31 37.1,15.65 38.15,16.7 T2.1
N$16
  Bottom 0.254: R34.2 22.65,16.8 STECKER4.4
N$18  (via drill 0.25)
  Top 0.152: TVS2.4 8.21,30.38 v6.59,28.76
  Bottom 0.152: v6.59,28.76 6.62,28.79
  Bottom 0.254: v6.59,28.76 6.46,28.89 F1.2 6.68,30 R17.1
N$19  (via drill 0.25)
  Top 0.152: v4.55,31.2 TVS2.3
  Bottom 0.152: F6.2
  Bottom 0.254: F6.2 v4.55,31.2 | F6.2 6.36,32 R19.1
N$20  (via drill 0.25)
  Top 0.2: TVS2.1 4.88,33.09 v4.58,33.4
  Bottom 0.254: v4.58,33.4 F7.2 6.32,34.15 R24.1
N$21  (via drill 0.25)
  Top 0.2: v5.52,37.15 8.21,34.46 TVS2.6
  Bottom 0.2: v5.52,37.15 6,37.15 R27.1
  Bottom 0.254: F8.2 5.57,37.1 v5.52,37.15 5.52,37.12
N$22
  Top 0.254: TVS2.5 8.3,32.04 9,32.04 9.08,31.96 9.08,30.09 8.29,29.29 8.29,27.87 C16.2
N$23  (via drill 0.25)
  Top 0.254: TVS4.3 v4.58,22.29 v4.58,22.3
  Bottom 0.254: R28.1 6.56,21.32 F10.2 v4.58,22.3
N$24  (via drill 0.25)
  Top 0.254: v4.75,26.7 7.26,24.19 TVS4.6
  Bottom 0.254: R30.1 6.97,25.3 F12.2 v4.75,26.7
N$25  (via drill 0.25)
  Top 0.254: TVS4.5 8.58,23.61 8.9,23.61 9.07,23.78 9.07,25.22 7.64,26.65 7.64,28.57 v7.67,28.57
  Bottom 0.254: C17.2 7.92,28.57 v7.67,28.57
N$26  (via drill 0.25)
  Top 0.254: TVS4.1 4.86,24.19 v4.55,24.5
  Bottom 0.254: R29.1 6.79,23.28 F11.2 v4.55,24.5
N$27  (via drill 0.25)
  Top 0.254: v4.75,20 7.04,22.29 TVS4.4
  Bottom 0.254: R23.1 6.19,19.38 F9.2 v4.76,19.99 v4.75,20
N$28  (via drill 0.25)
  Top 0.254: v33.74,36.3 32.48,37.57 R51.2
  Bottom 0.254: Q2.1 R50.1 33.68,36.3 v33.74,36.3
N$29  (via drill 0.25)
  Top 0.254: STECKER3.5 23.13,45.6 17.52,39.99 14.18,39.99 10.77,43.4 v10.77,43.67
  Bottom 0.254: v10.77,43.67 10.77,45.62 R36.2
N$30  (via drill 0.25)
  Top 0.254: STECKER3.6 24.8,46.67 24.13,46.01 24.13,45.51 23.54,44.92 23.04,44.92 17.7,39.57 13.88,39.57 12.97,38.67 v12.72,38.67
  Bottom 0.254: v12.72,38.67 12.22,38.67 R37.2
N$33  (via drill 0.25)
  Top 0.254: v44.15,23.95 43.48,23.95 TVS6.3
  Bottom 0.254: v44.15,23.95 v44.14,23.94 F18.2 42.72,24.5 R41.1
N$34  (via drill 0.25)
  Top 0.254: TVS6.6 41.46,20.55 v44.38,20.55
  Bottom 0.254: v44.38,20.55 43.38,19.55 F20.2 42.33,20.5 R25.1
N$35
  Top 0.254: 42.51,26.94 C19.2 43.01,26.54 44.18,26.54 45.41,25.31 45.41,22.49 43.89,20.96 42.24,20.96 41.8,21.4 41.8,21.9 41.19,22.51 TVS6.5
N$36  (via drill 0.25)
  Top 0.254: TVS6.1 43.61,21.56 v44.1,22.05
  Bottom 0.254: v44.1,22.05 43.8,21.75 F19.2 42.38,21.75 41.73,22.4 R40.1
N$37  (via drill 0.25)
  Top 0.254: TVS6.4 42.09,25.1 v43.9,25.1
  Bottom 0.254: R42.1 43.09,26.45 F17.2 43.9,25.64 v43.9,25.1
N$38  (via drill 0.25)
  Top 0.254: TVS7.3 43.61,32.36 v44.1,32.85
  Bottom 0.254: v44.1,32.85 v44.09,32.84 F22.2 43.13,33.59 41.73,35 R43.1
N$39  (via drill 0.25)
  Top 0.254: v40.77,29.66 40.45,29.98 TVS7.6
  Bottom 0.254: F24.2 43.13,29.15 41.73,30.55 R45.1 41.73,30.65 40.77,29.69 v40.77,29.66
N$40  (via drill 0.25)
  Top 0.254: TVS7.5 41.49,31.41 42.1,30.8 42.1,29.9 v40.93,28.72
  Bottom 0.254: C20.2 41.71,28.87 41.08,28.87 v40.93,28.72
N$41
  Top 0.254: LED1.A 43.98,42.22 | 43.98,42.22 43.7,42.5 LED2.A | R16.1 42.63,40.88 43.98,42.22
N$42  (via drill 0.25)
  Top 0.254: TVS7.1 44.01,30.46 v44.15,30.6
  Bottom 0.254: v44.15,30.6 43.18,30.6 F23.2 43.13,31.45 42.78,31.8 42.68,31.8 42.51,31.96 42.51,32.14 R44.1
N$43  (via drill 0.25)
  Top 0.254: TVS7.4 43.17,35.08 v44.13,35.08
  Bottom 0.254: v44.13,35.08 43.21,35.08 F21.2 43.13,36.04 41.98,37.2 R26.1
N$47  (via drill 0.2)
  Top 0.254: v22.85,42.55 22.97,42.55 26.84,46.42 27.54,46.71 27.77,47.26 STECKER3.8 | v23.09,38.59 23.14,38.59 23.43,38.3 23.9,38.3 R47.2
  Bottom 0.254: v22.85,42.55 23.18,42.22 23.18,38.68 v23.09,38.59
N$48  (via drill 0.2)
  Top 0.254: STECKER3.7 25.92,46.51 25.69,45.96 25.15,45.74 22.2,42.79 22.2,42.5 v21.9,42.2 | R46.2 23.55,36.9 22.5,37.95 22.5,39.22 v22.57,39.3
  Bottom 0.254: v21.9,42.2 22.55,41.55 22.55,39.32 v22.57,39.3
N$49
  Top 0.254: STECKER4.7 18.02,17.82 25.52,17.82 26.85,19.15 R49.2
N$52
  Top 0.254: R48.2 25.1,24.8 25.1,19.46 24.29,18.65 16.85,18.65 STECKER4.8
OLD_REF
  Top 0.254: 36.2,10.31 R3.1 | 34.81,9.39 R4.2 R3.1 | D5.C 36.65,9.74 R3.1
PROG
  Top 0.254: JP8.1 41.58,44.36 | 41.58,44.36 LED2.K | LED1.C 41.58,44.62 41.58,44.36
  Bottom 0.2: JP8.1 38.8,39.14 38.35,38.68 28.53,38.68 26.9,37.05 26.9,35.23 26.6,34.93 IC1.2
REF
  Top 0.254: R12.1 33.84,11.25 33.84,8.91 32.98,8.05 D6.A 33.7,7.2 38.15,7.2 38.85,7.9 D5.A
RESET  (via drill 0.25)
  Top 0.254: TVS3.1 28.3,42.07 28.88,41.5 R31.2 29.6,41.49 30.1,40.99 30.1,35.56 30.07,35.54 | v27.44,34.81 27.46,34.79 29.32,34.79 30.07,35.54 | 30.07,35.54 30.08,35.54 C9.2 R14.1
  Bottom 0.254: v27.44,34.81 27.05,34.43 IC1.3
RXD2  (via drill 0.25)
  Top 0.254: v12.92,39.7 12.9,39.7 11.65,40.95 TVS1.3 6.85,42.88 v6.23,42.88
  Bottom 0.254: IC1.37 17.29,36.98 17.28,36.97 14.55,39.7 v12.92,39.7 | R36.1 7.58,45.62 6.23,44.27 v6.23,42.88
SWCLK  (via drill 0.25)
  Top 0.254: v19,32.15 19.25,32.4 19.25,39.85 20.21,40.81 28.52,40.81 28.62,40.7 R31.3 28.57,40.7 TVS3.6
  Bottom 0.254: IC1.29 18.78,31.93 v19,32.15
SWD_SWDIO
  Top 0.254: R31.8 31.76,42.34 JP7.2
SWDIO  (via drill 0.25)
  Top 0.254: v21.93,39.77 22.08,39.92 25.1,39.92 TVS3.4 25.87,39.15 25.87,38.83 26.04,38.66 28.09,38.66 R31.4
  Bottom 0.254: v21.93,39.77 21.8,39.77 19.82,37.79 IC1.39
TXD2  (via drill 0.25)
  Top 0.254: 10.52,38.2 v10.55,38.2 10.17,38.2 9.32,39.05 TVS1.1
  Bottom 0.254: IC1.36 16.64,35.43 14.05,38.02 10.72,38.02 v10.55,38.2 10.55,39.38 R37.1
XTAL_EN  (via drill 0.25)
  Top 0.254: R51.1 34.35,37.7 34.35,33.75 32.48,31.88 v28.07,31.88
  Bottom 0.254: v28.07,31.88 27.81,31.88 27.37,31.43 IC1.9
XTALIN
  Bottom 0.2: C7.2 C8.1 29.41,26.6 27.95,26.6 24.4,30.15 24.4,32.58 24.75,32.93 IC1.6

### Text on the board
tDocu: Connector 1